# Altium project C27337A_NI_STS_IFX_C55SOI_302149633_V3_04.PrjPcb
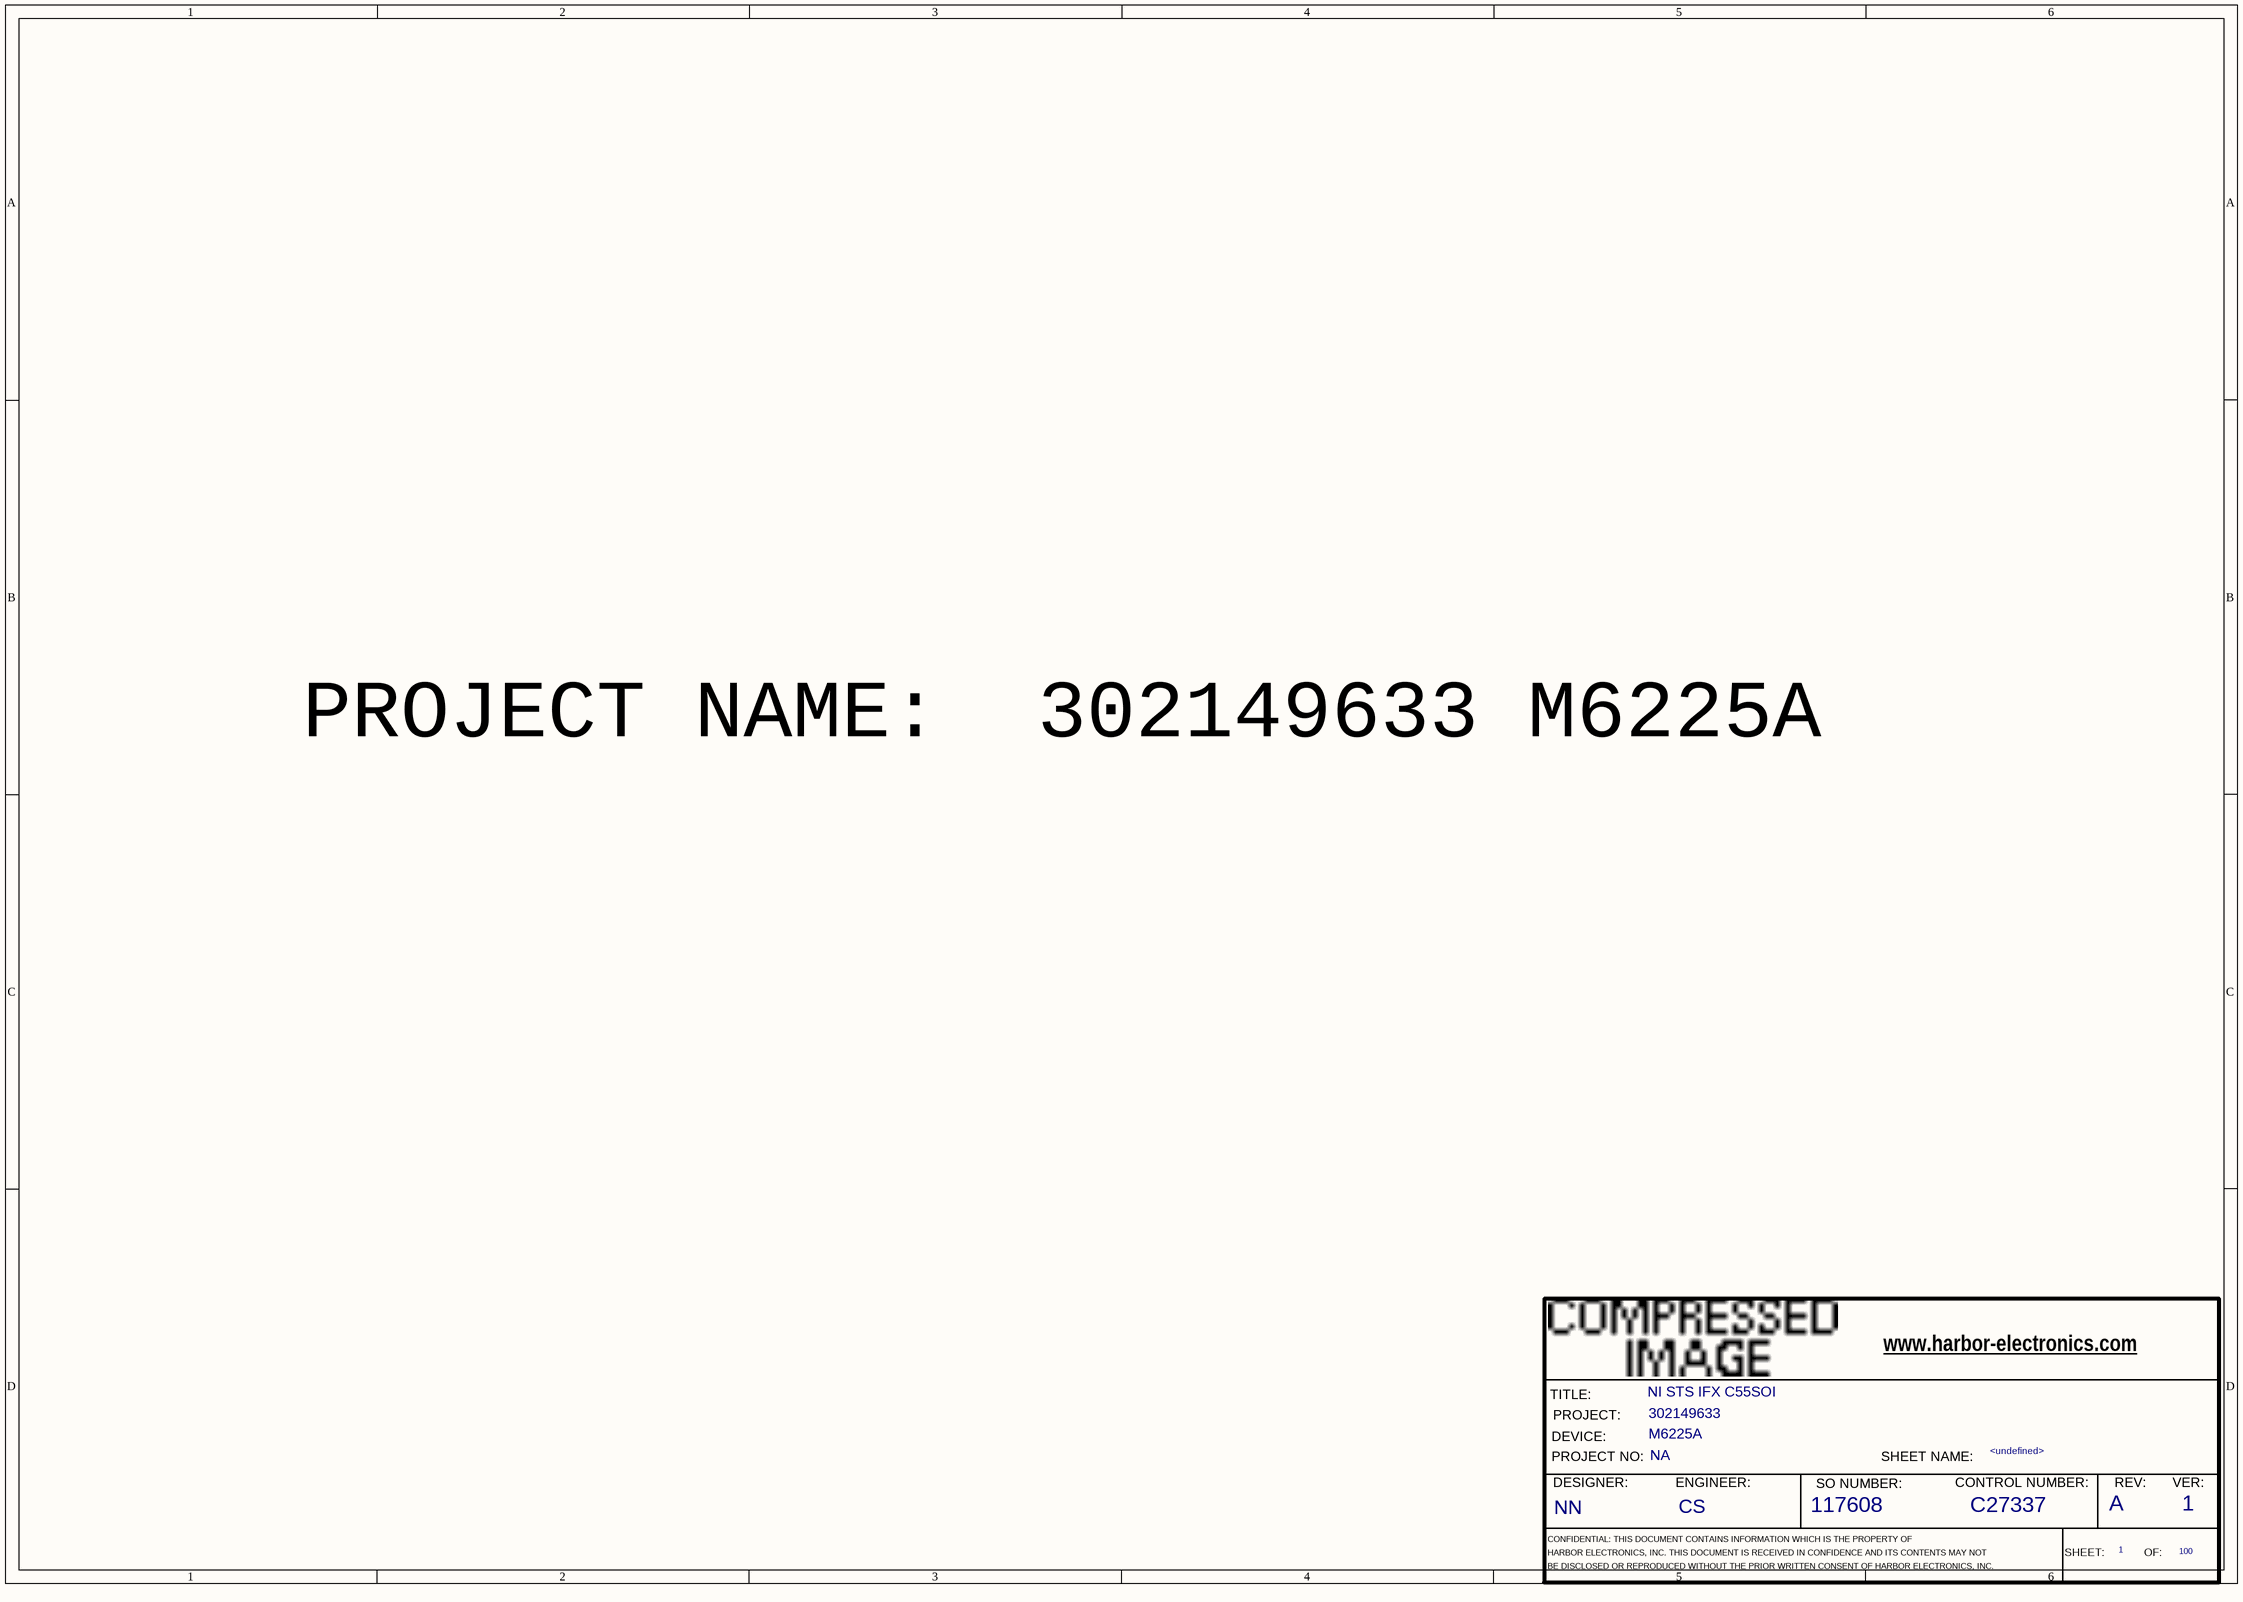
[diagram p0: 01-TITLE.SchDoc]
7 sheets, 29 parts. Net scope: flat (ports and power ports of the same name join across sheets).
Board file: c27337a_ni_sts_ifx_c55soi_302149633_m6225a_v1_23.brd.PcbDoc
Sheets:
  01-TITLE.SchDoc
  02-REVISION.SchDoc
  03-TESTER_CONFIG.SchDoc
  40-DIGITAL.SchDoc
  42-MIO.SchDoc
  47-SOURCES_AWG.SchDoc
  51-BLANK 121-140.SchDoc

## Sheet 01-TITLE.SchDoc
size 420 x 297 mm

### Parts
(Parts that share a designator on the sheet are numbered #1, #2 ... from top to bottom, then left to right.)
*#1  RevCode: A  Title: NI STS IFX C55SOI  Page Number: 1  Page Count: 100  Engineer: CS  Designer: NN  SO Number: 117608  Control Number: C27337  Page Name: <undefined>  PROJECT: 302149633  DEVICE: M6225A  PROJECT NO.: NA  (hidden comment: HE_DEFAULT)  (graphical)

### Notes on the sheet
- PROJECT NAME:  302149633 M6225A
- (in symbol HE_DEFAULT) www.harbor-electronics.com; TITLE:; PROJECT:; DEVICE:; PROJECT NO:; SHEET NAME:; DESIGNER:; ENGINEER:; CONTROL NUMBER:; REV:; VER:; SO NUMBER:; CONFIDENTIAL: THIS DOCUMENT CONTAINS INFORMATION WHICH IS THE PROPERTY OF; HARBOR ELECTRONICS, INC. THIS DOCUMENT IS RECEIVED IN CONFIDENCE AND ITS CONTENTS MAY NOT; SHEET:; OF:; BE DISCLOSED OR REPRODUCED WITHOUT THE PRIOR WRITTEN CONSENT OF HARBOR ELECTRONICS, INC.

### Library data of the parts
*#1 = HE_DEFAULT: Page Size: X; OrgAddr4: Fax: +1 602-431-9633; OrgAddr1: 4050 E. Cotton Center Blvd., Suite 33; OrgAddr2: Phoenix, Arizona 85040 U.S.A.; OrgAddr3: Phone: +1 602-438-1112; Doc: <Title Name>; OrgName: HARBOR; Version: 1

## Sheet 02-REVISION.SchDoc
size 420 x 297 mm
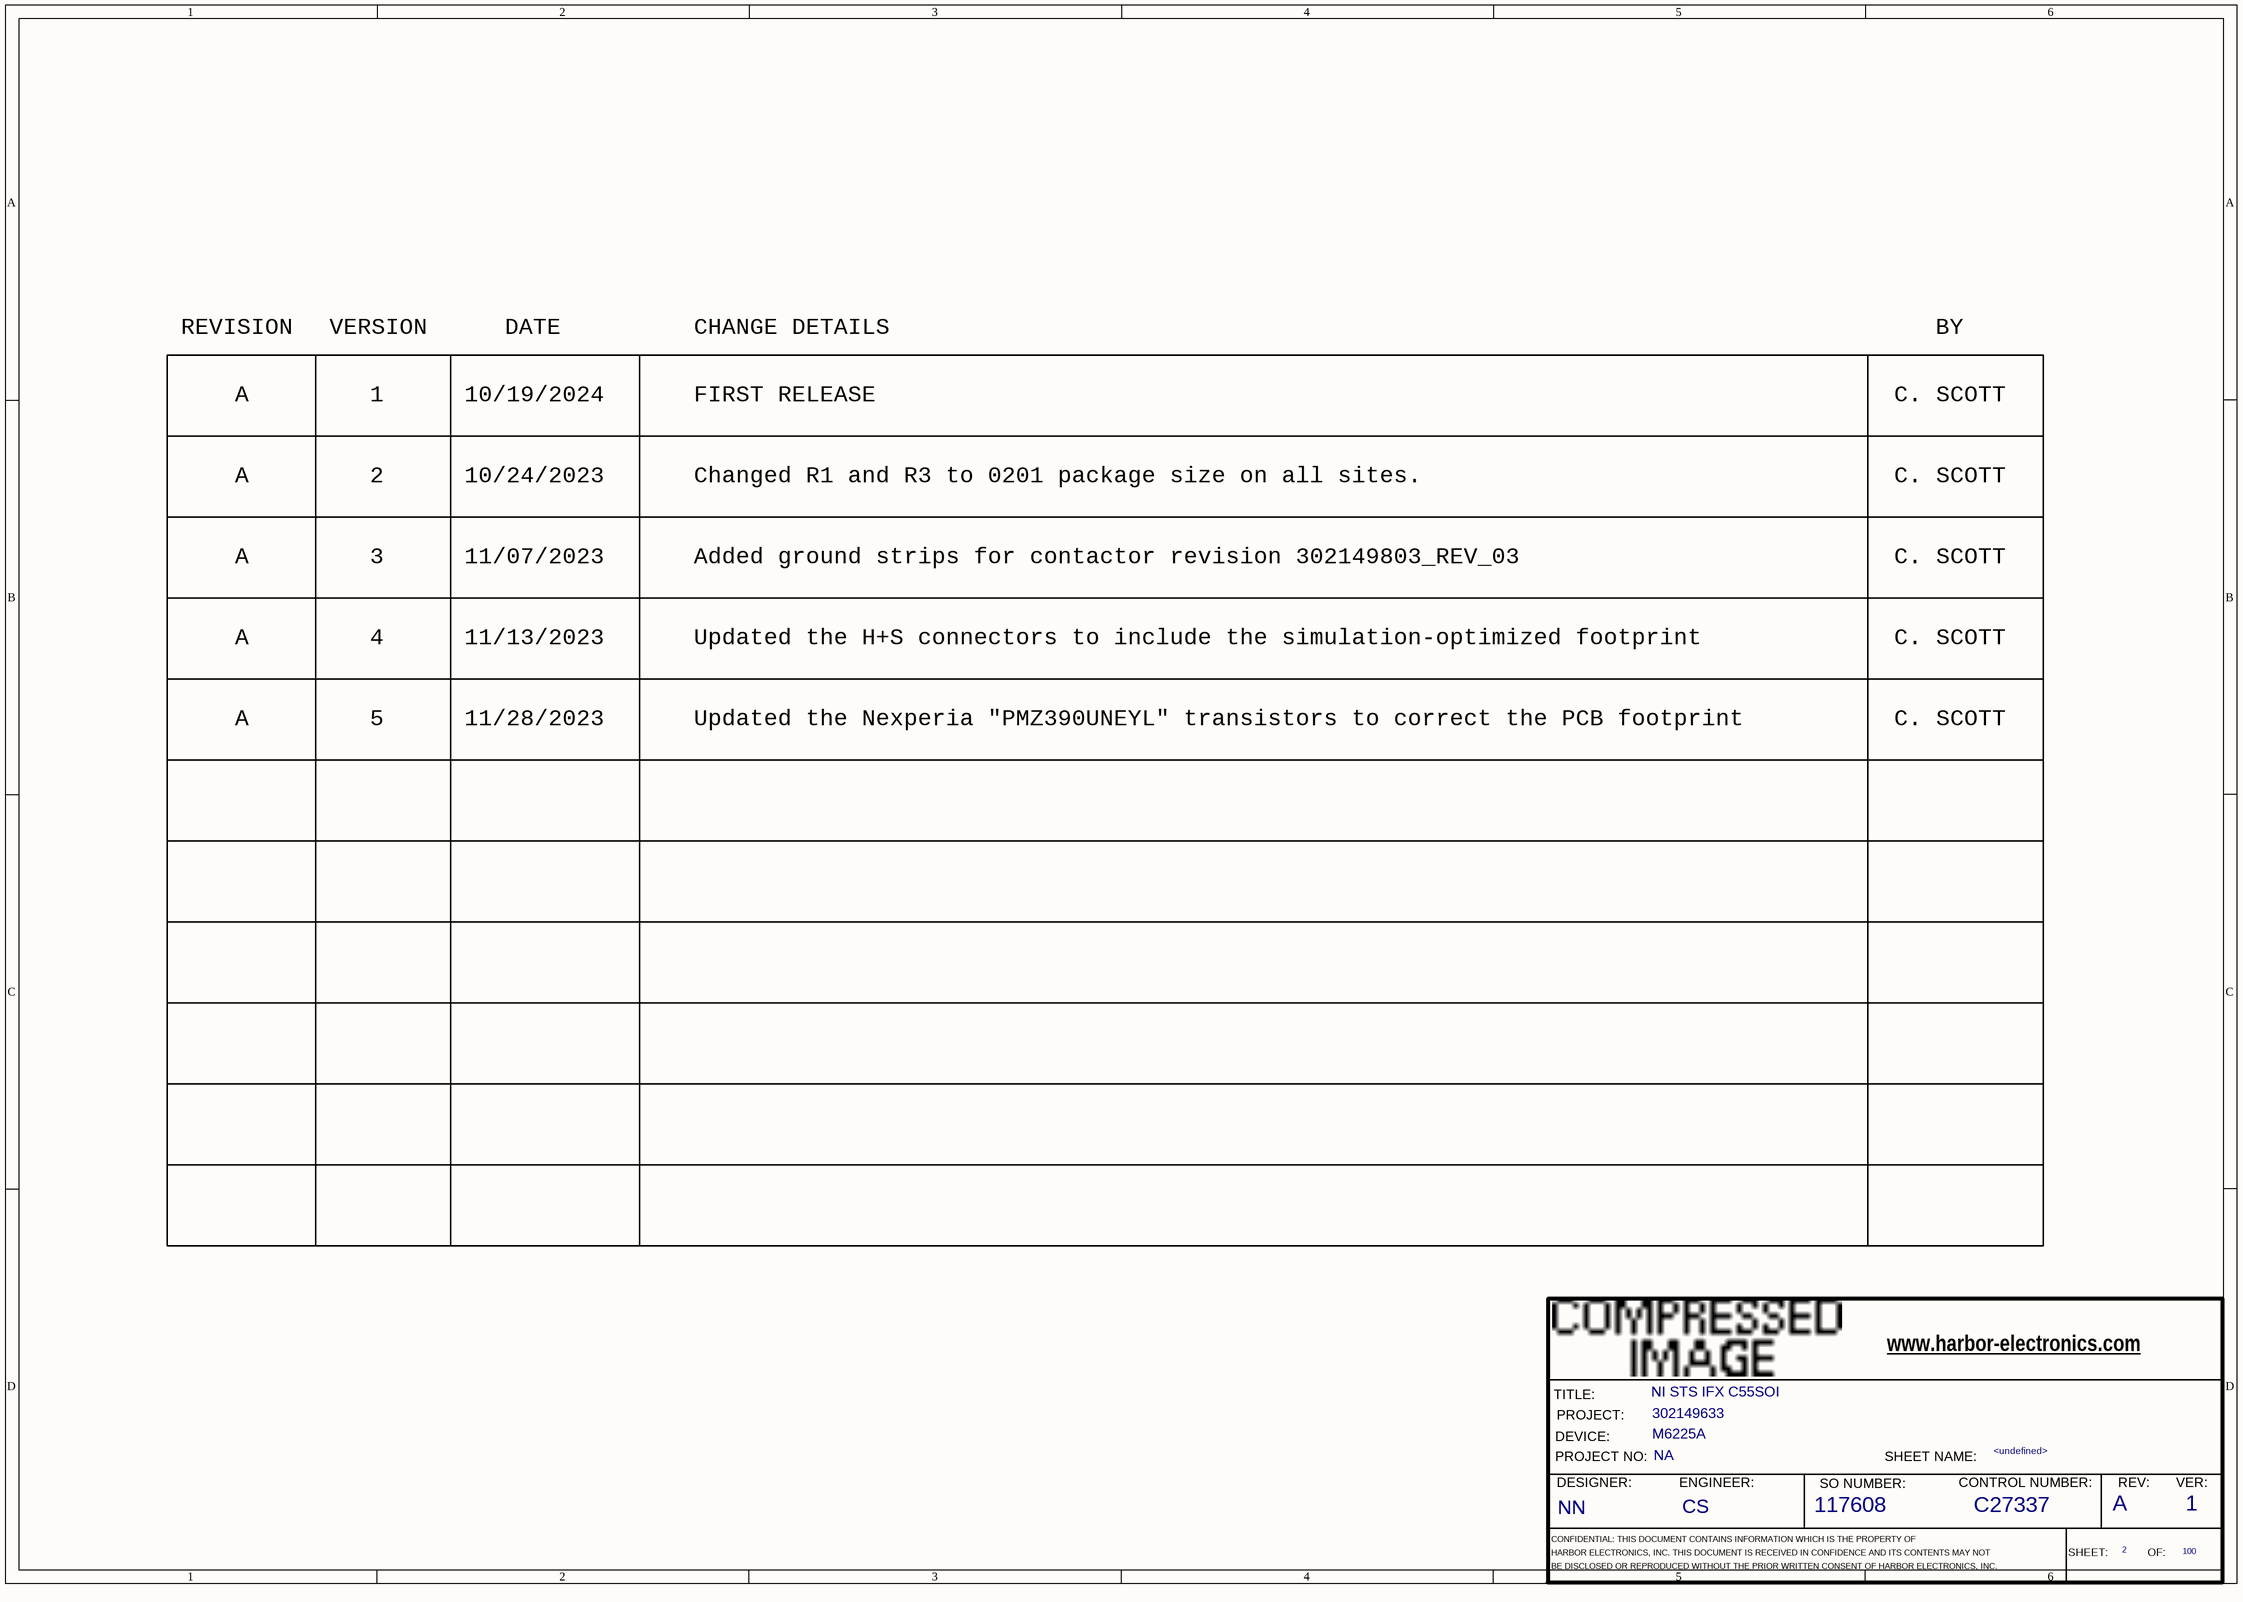
[diagram p1: 02-REVISION.SchDoc]

### Parts
(Parts that share a designator on the sheet are numbered #1, #2 ... from top to bottom, then left to right.)
*#2  RevCode: A  Title: NI STS IFX C55SOI  Page Number: 2  Page Count: 100  Engineer: CS  Designer: NN  SO Number: 117608  Control Number: C27337  Version: 1  Page Name: <undefined>  PROJECT: 302149633  DEVICE: M6225A  PROJECT NO.: NA  (hidden comment: HE_DEFAULT)  (graphical)

### Notes on the sheet
- REVISION
- VERSION
- DATE
- CHANGE DETAILS
- BY
- A
- 1
- 10/19/2024
- FIRST RELEASE
- C. SCOTT
- 2
- 10/24/2023
- Changed R1 and R3 to 0201 package size on all sites.
- 3
- 11/07/2023
- Added ground strips for contactor revision 302149803_REV_03
- 4
- 11/13/2023
- Updated the H+S connectors to include the simulation-optimized footprint
- 5
- 11/28/2023
- Updated the Nexperia "PMZ390UNEYL" transistors to correct the PCB footprint
- (in symbol HE_DEFAULT) www.harbor-electronics.com; TITLE:; PROJECT:; DEVICE:; PROJECT NO:; SHEET NAME:; DESIGNER:; ENGINEER:; CONTROL NUMBER:; REV:; VER:; SO NUMBER:; CONFIDENTIAL: THIS DOCUMENT CONTAINS INFORMATION WHICH IS THE PROPERTY OF; HARBOR ELECTRONICS, INC. THIS DOCUMENT IS RECEIVED IN CONFIDENCE AND ITS CONTENTS MAY NOT; SHEET:; OF:; BE DISCLOSED OR REPRODUCED WITHOUT THE PRIOR WRITTEN CONSENT OF HARBOR ELECTRONICS, INC.

### Library data of the parts
*#2 = HE_DEFAULT: as *#1 on sheet 01-TITLE

## Sheet 03-TESTER_CONFIG.SchDoc
size 594 x 420 mm
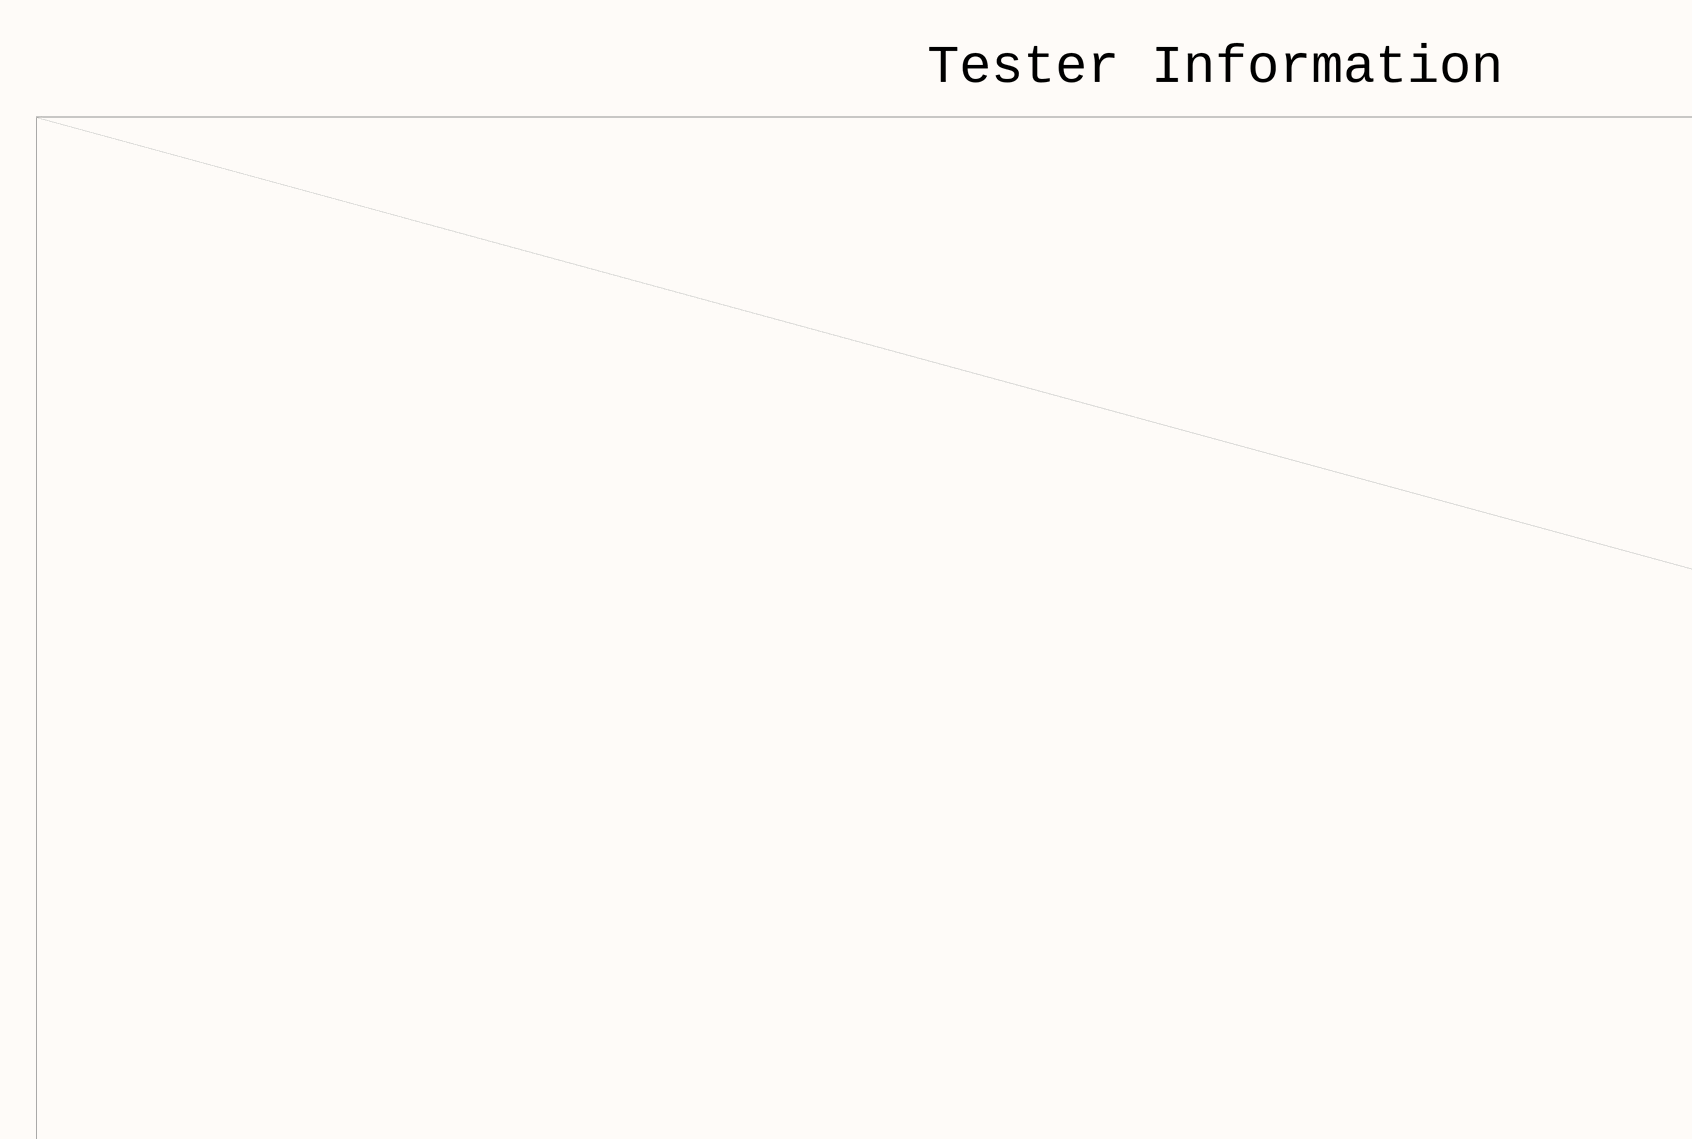
[diagram p2: 03-TESTER_CONFIG.SchDoc, top column 1 of 4]
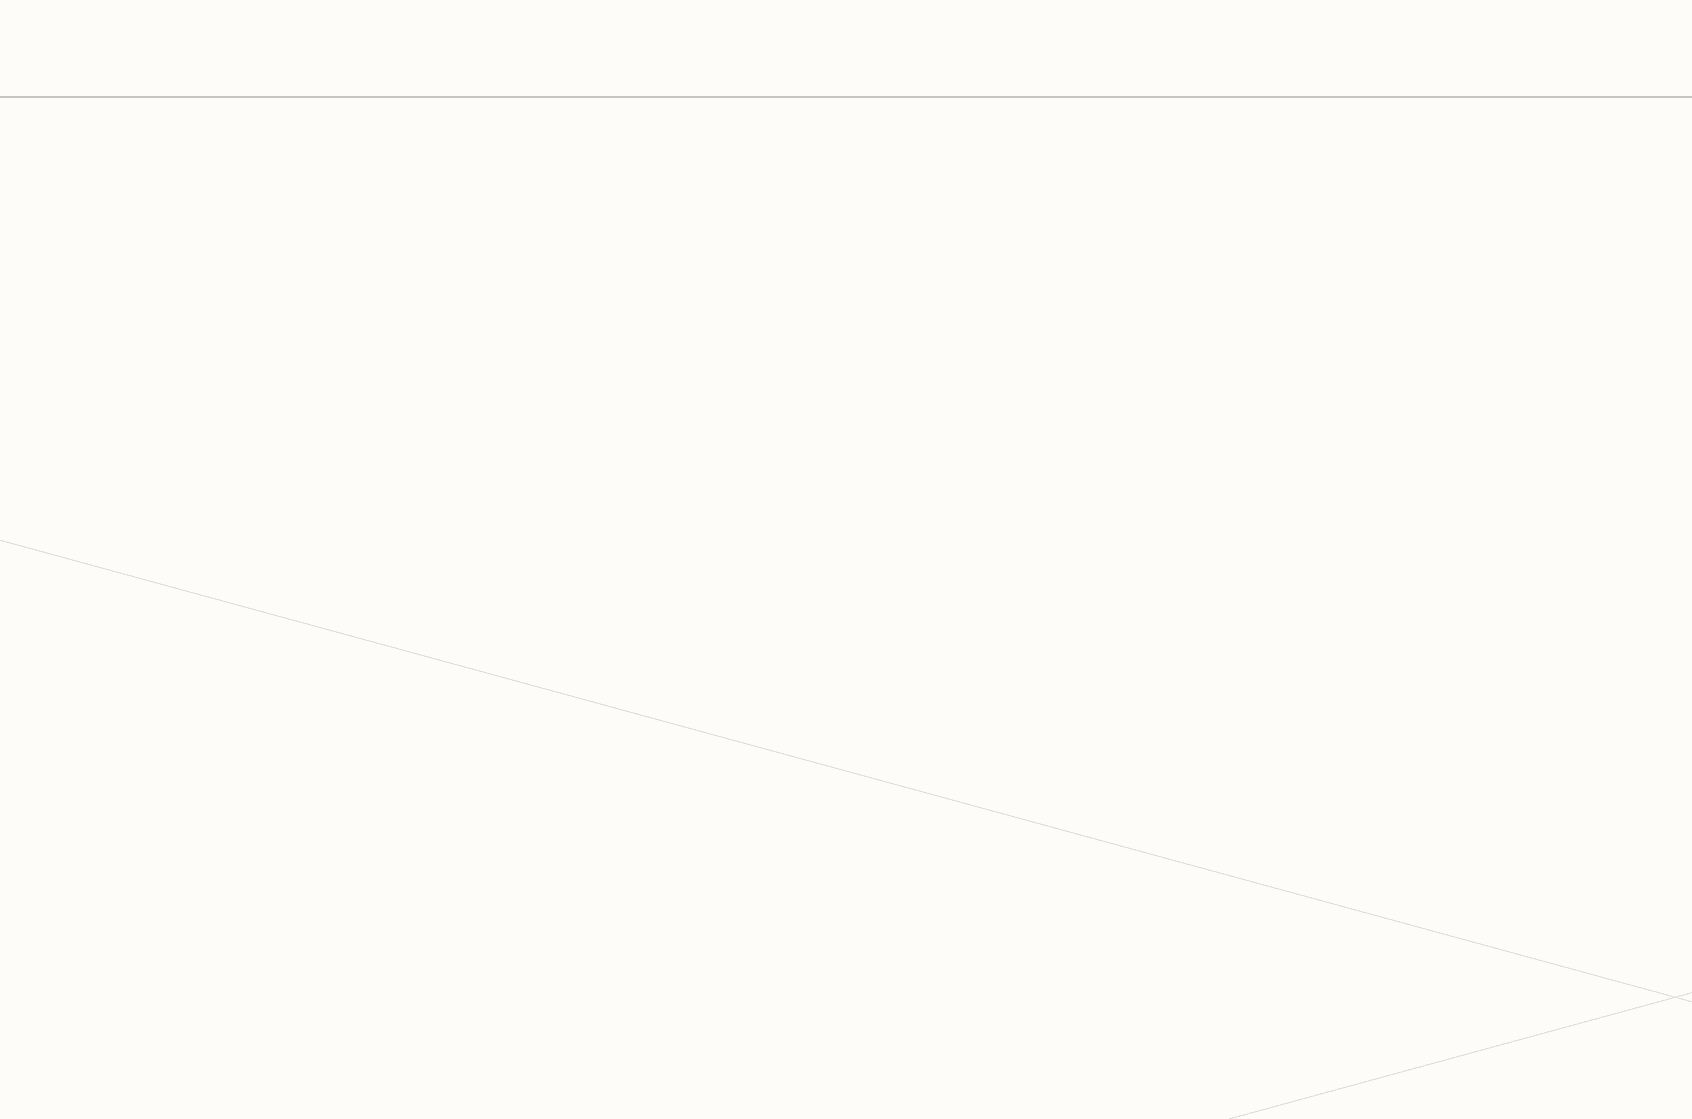
[diagram p3: 03-TESTER_CONFIG.SchDoc, top column 2 of 4]
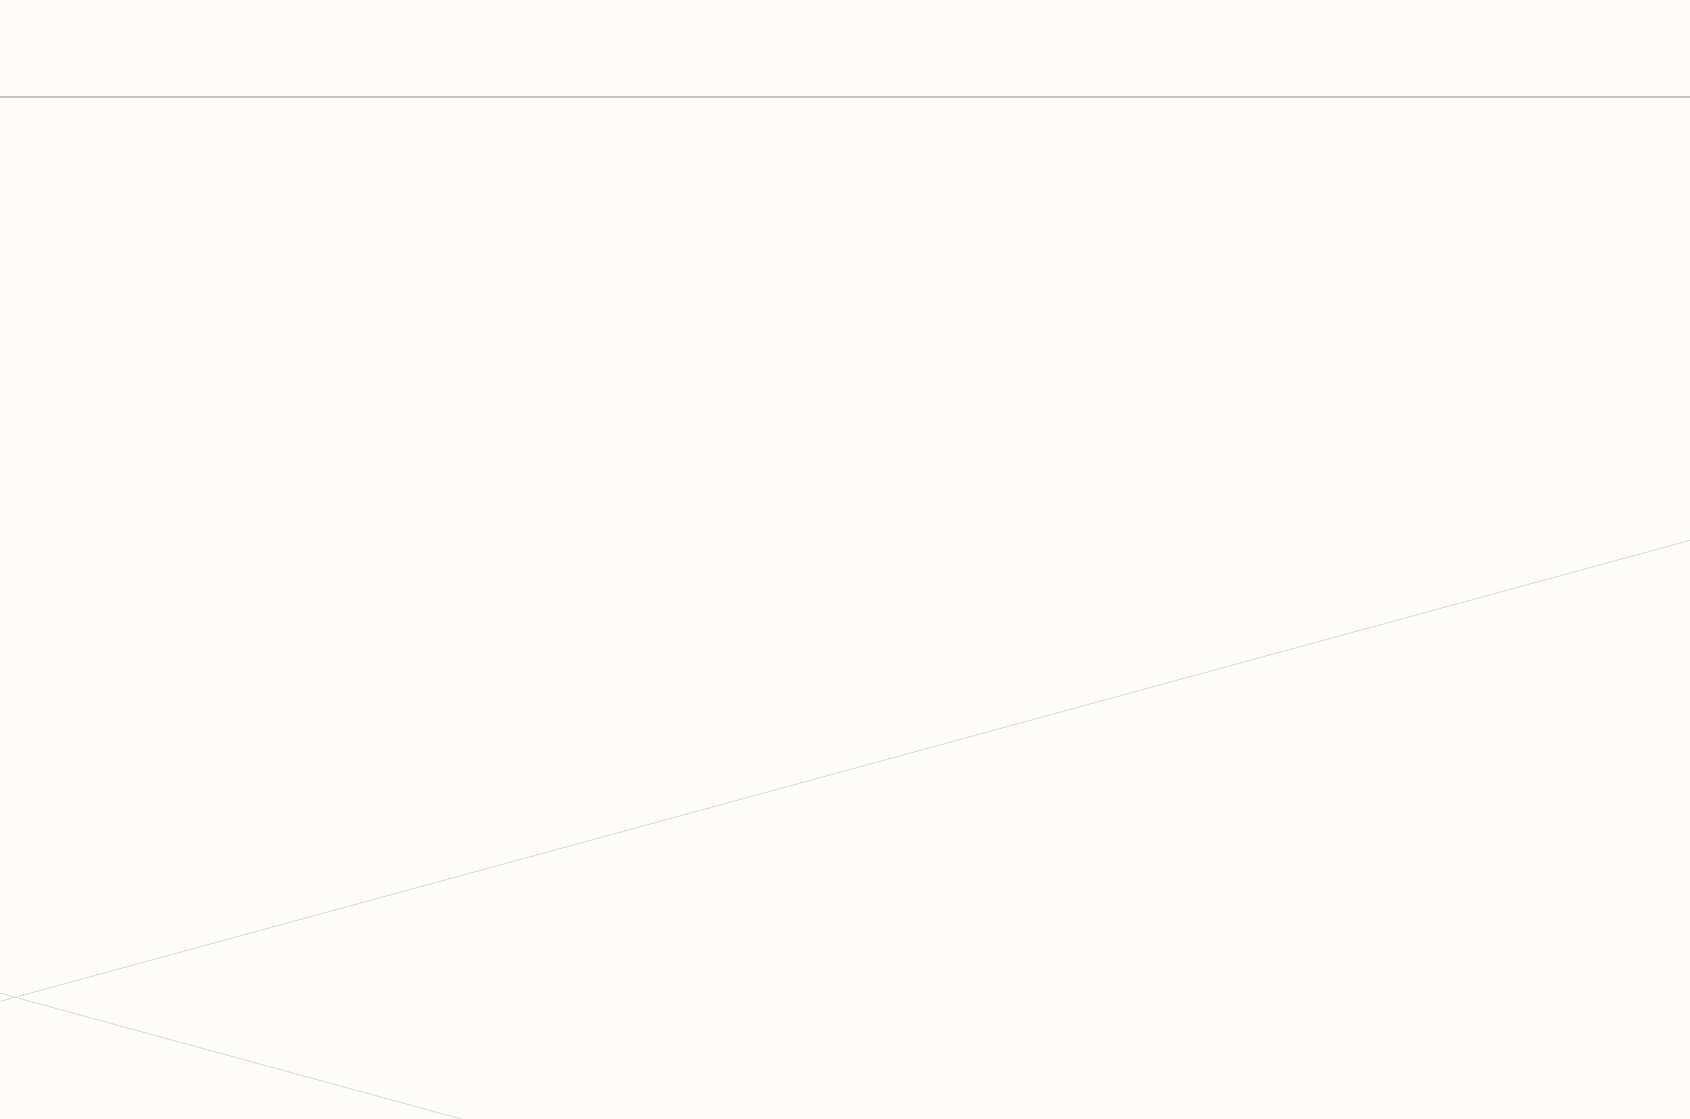
[diagram p4: 03-TESTER_CONFIG.SchDoc, top column 3 of 4]
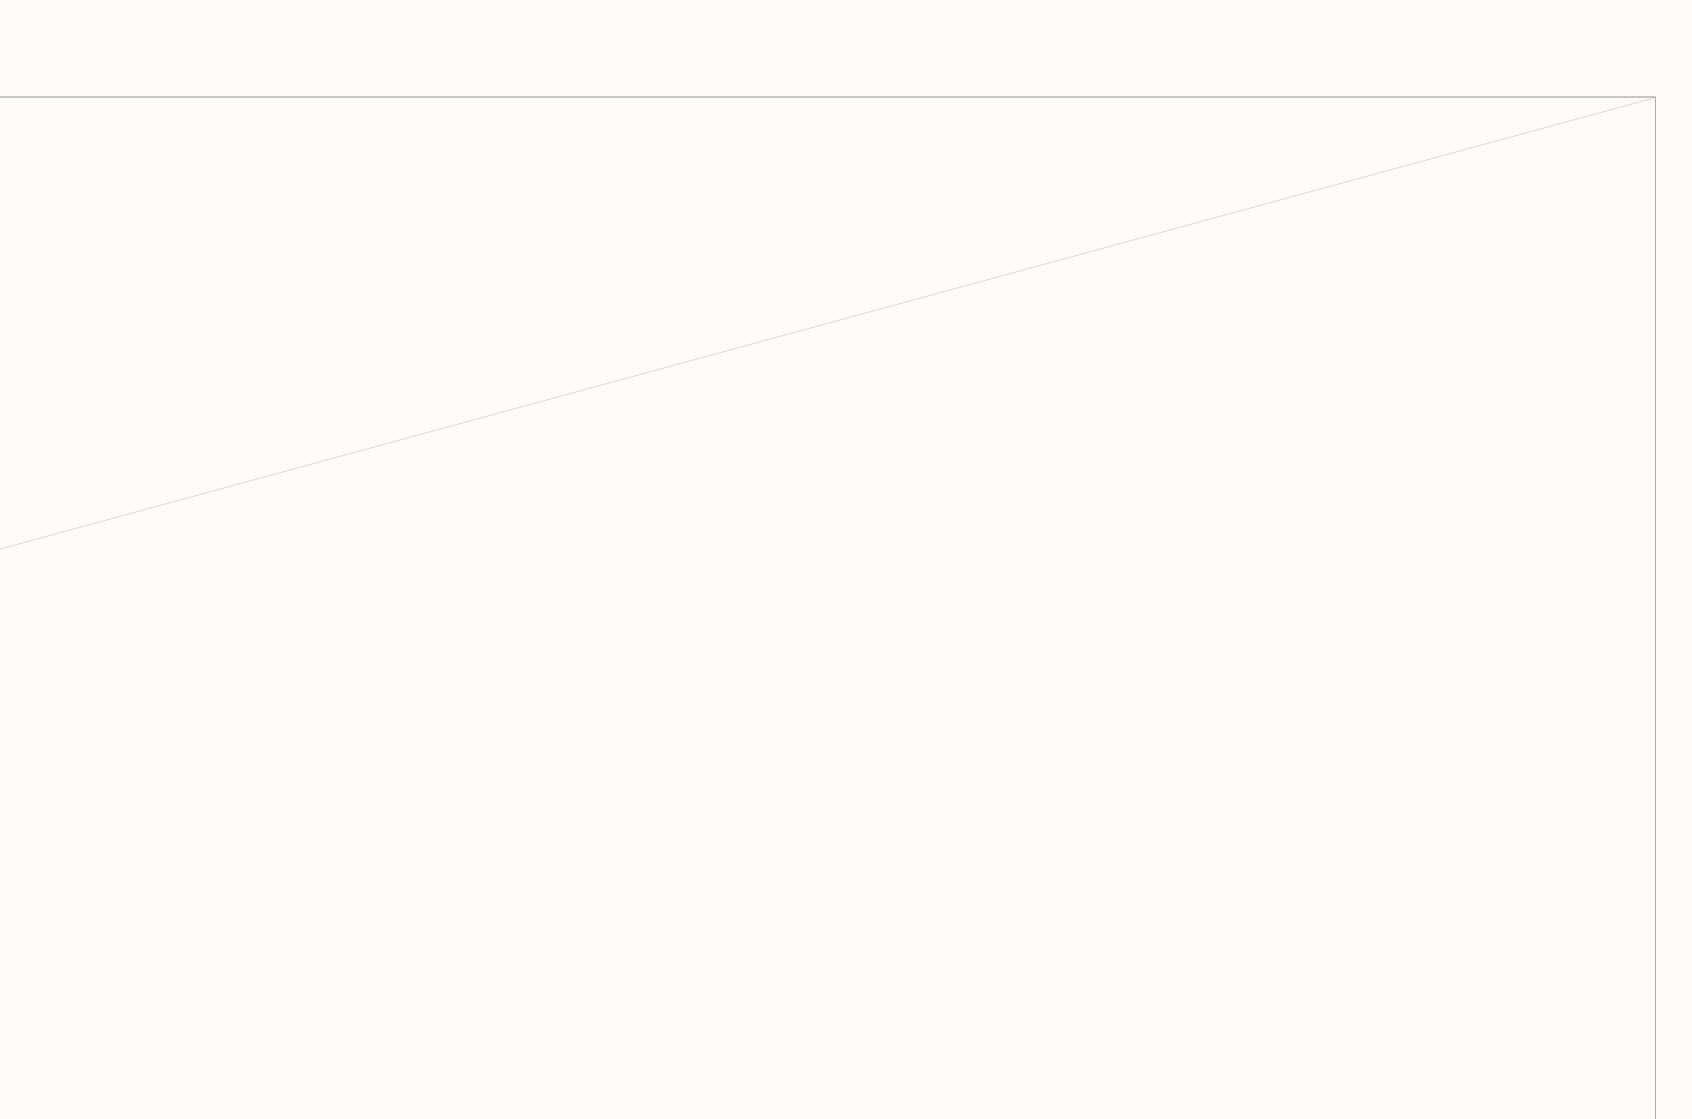
[diagram p5: 03-TESTER_CONFIG.SchDoc, top column 4 of 4]
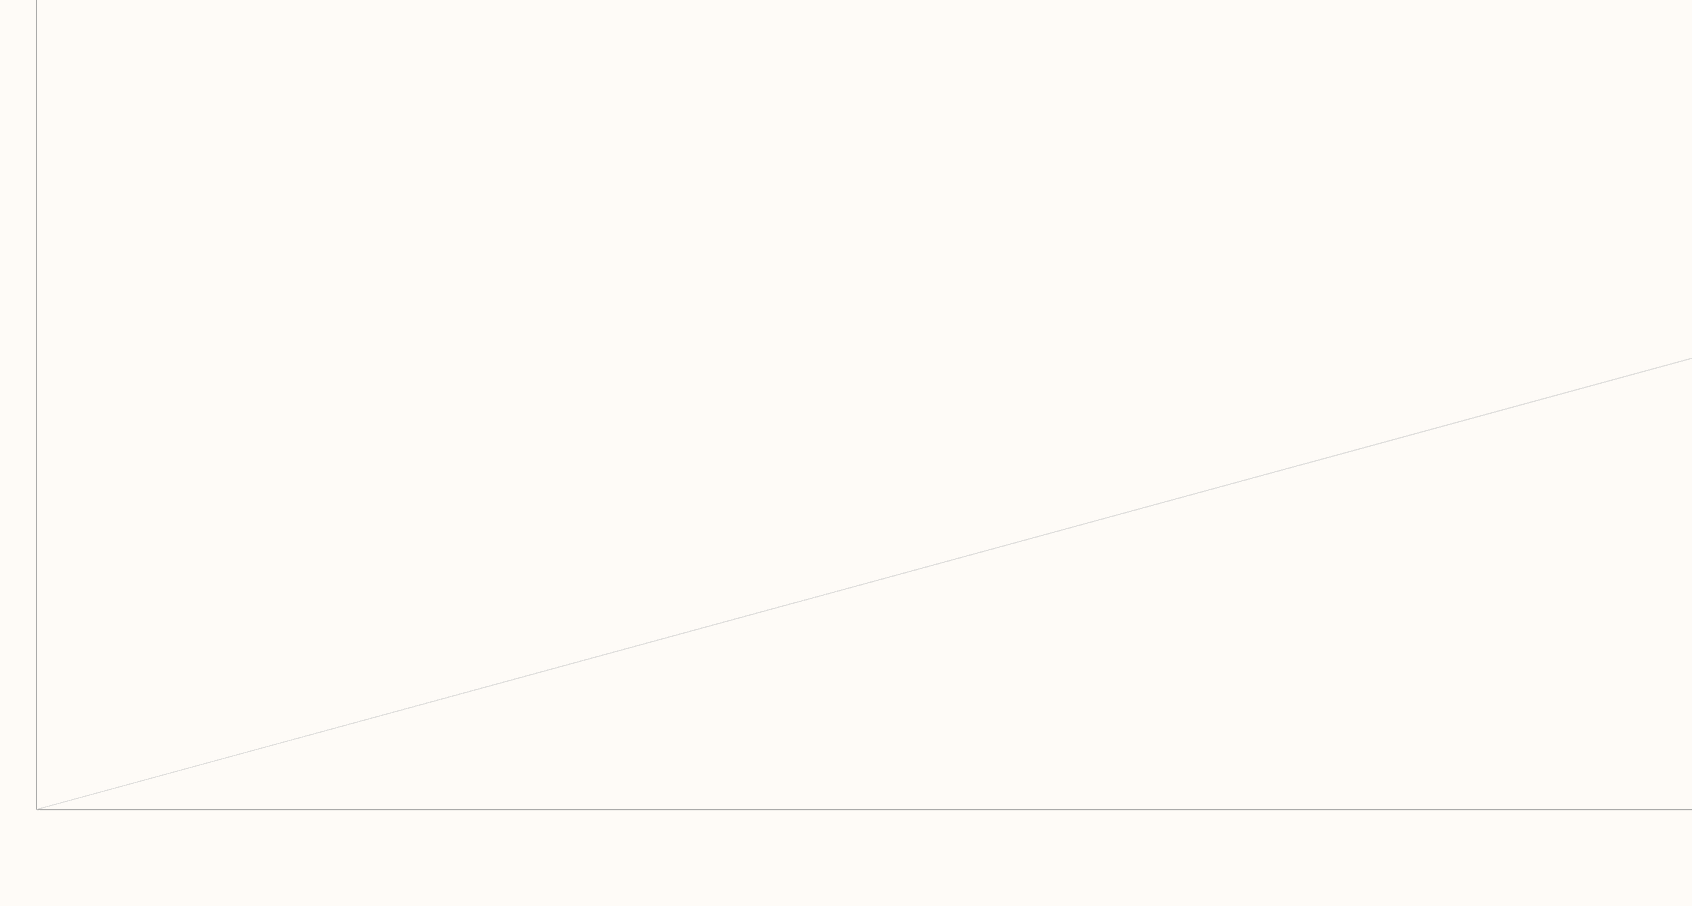
[diagram p6: 03-TESTER_CONFIG.SchDoc, bottom column 1 of 4]
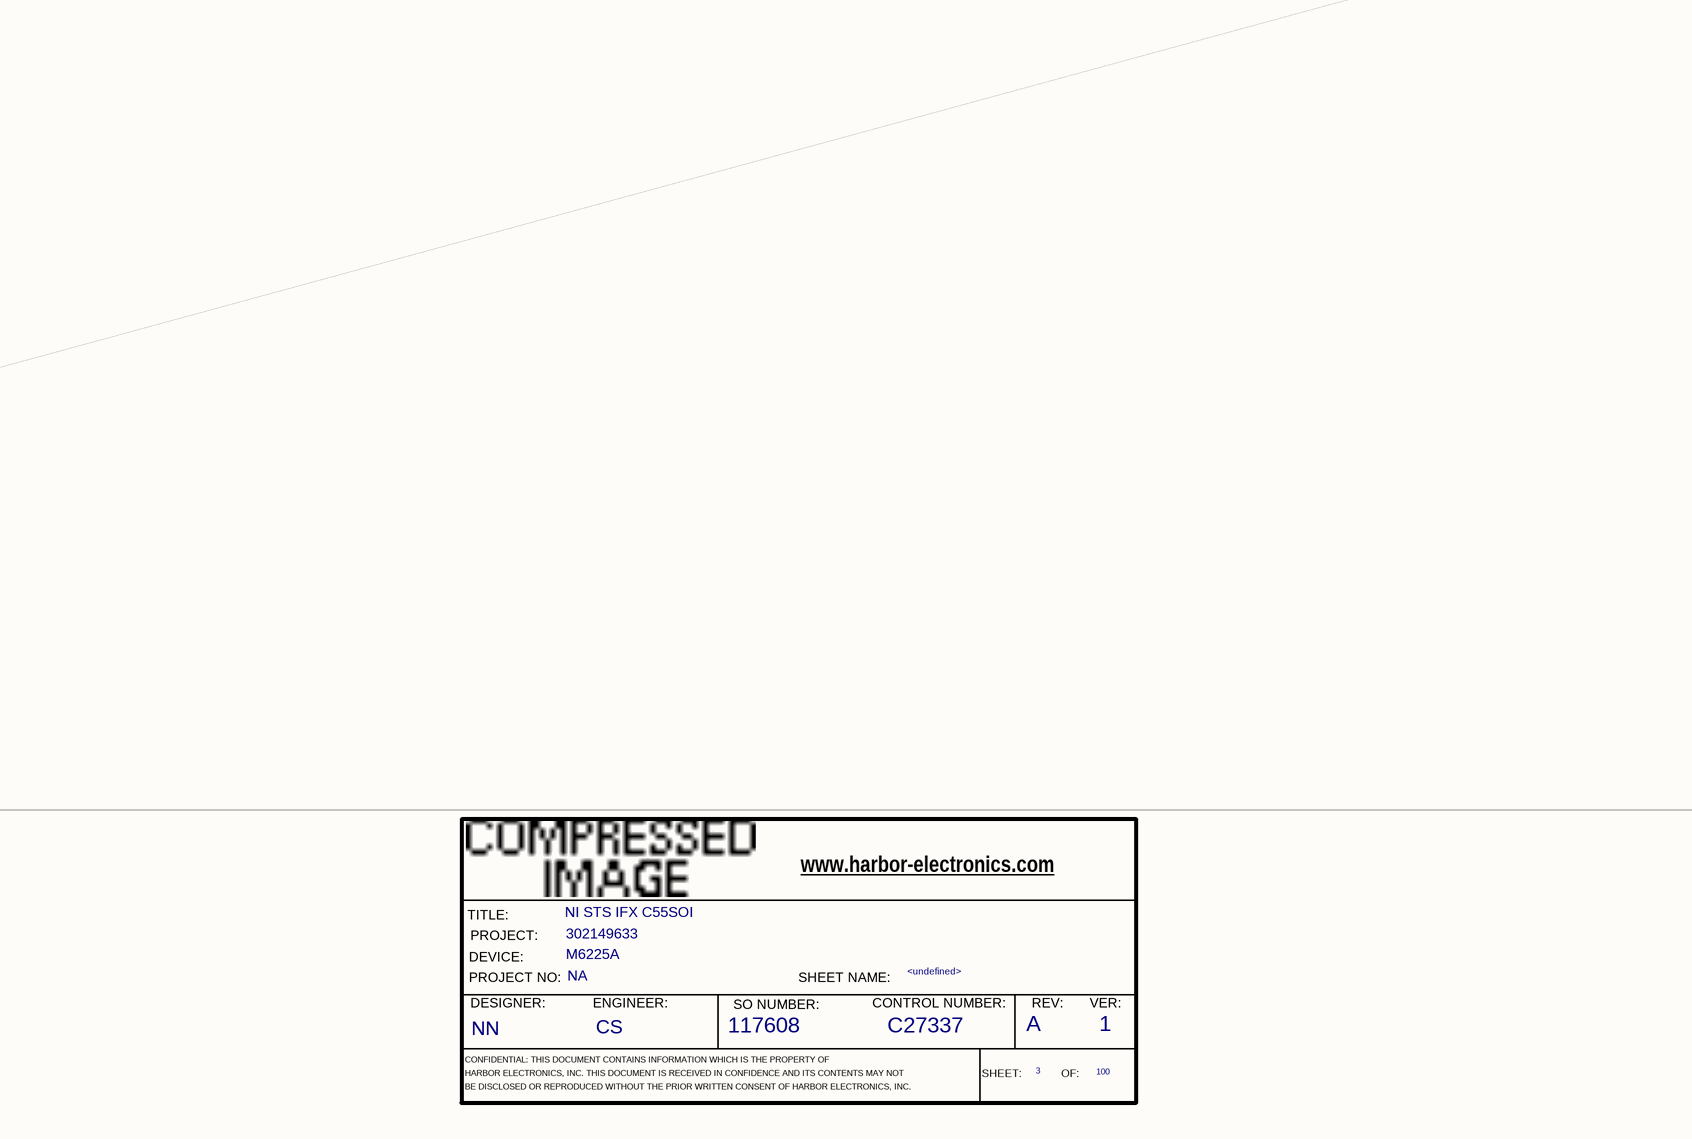
[diagram p7: 03-TESTER_CONFIG.SchDoc, bottom column 2 of 4]
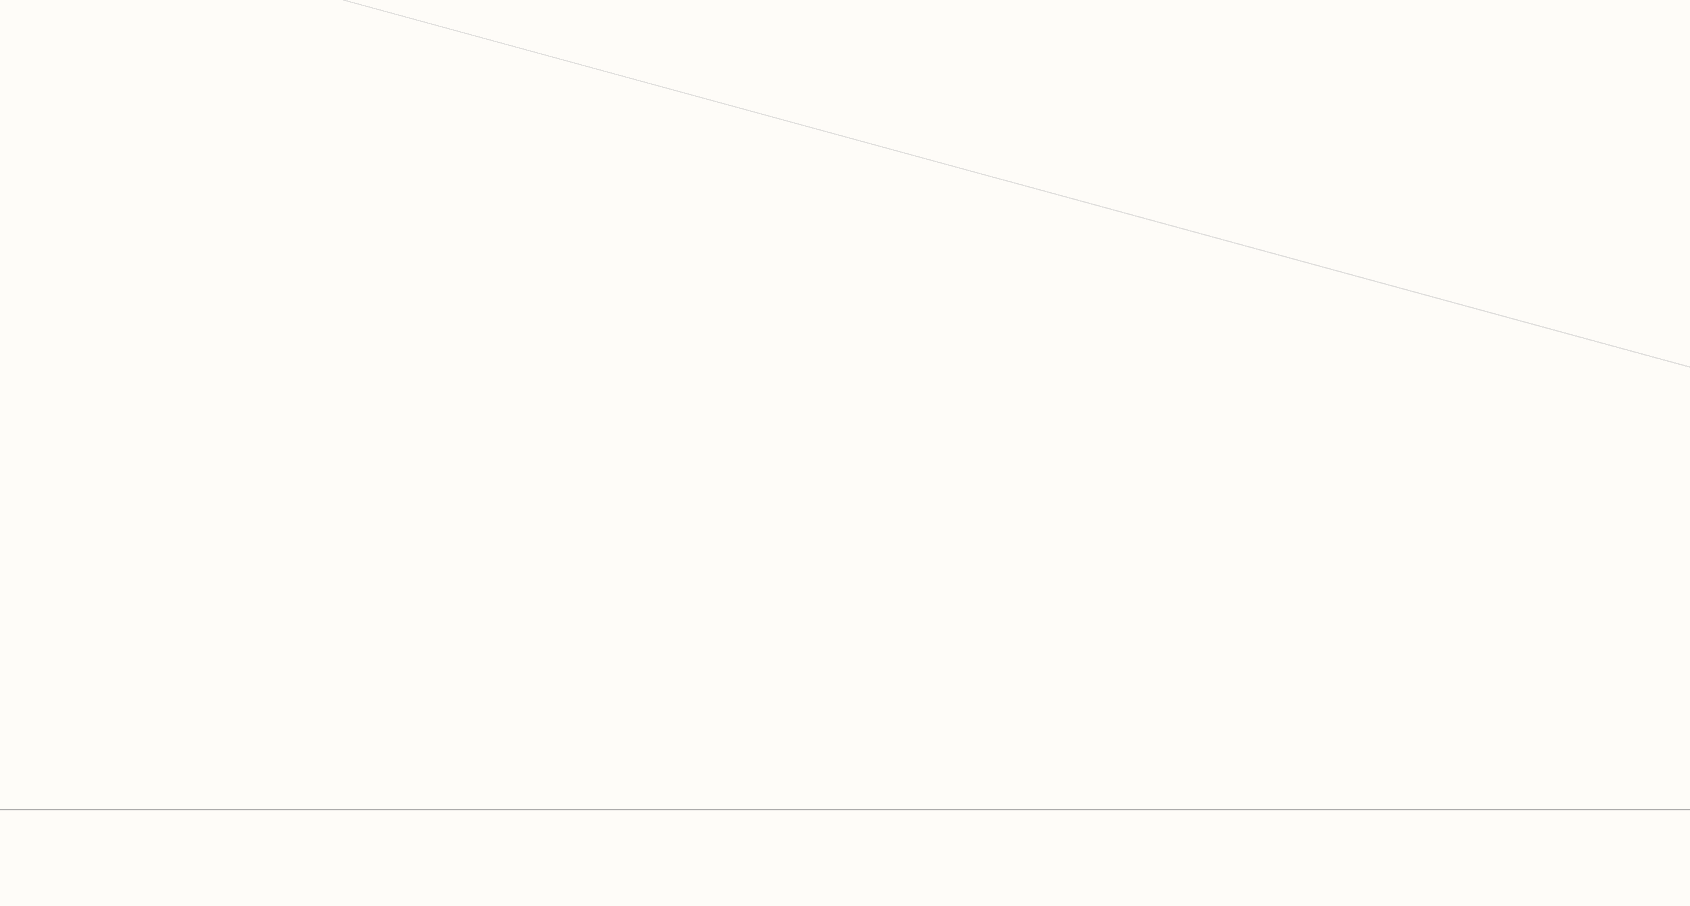
[diagram p8: 03-TESTER_CONFIG.SchDoc, bottom column 3 of 4]
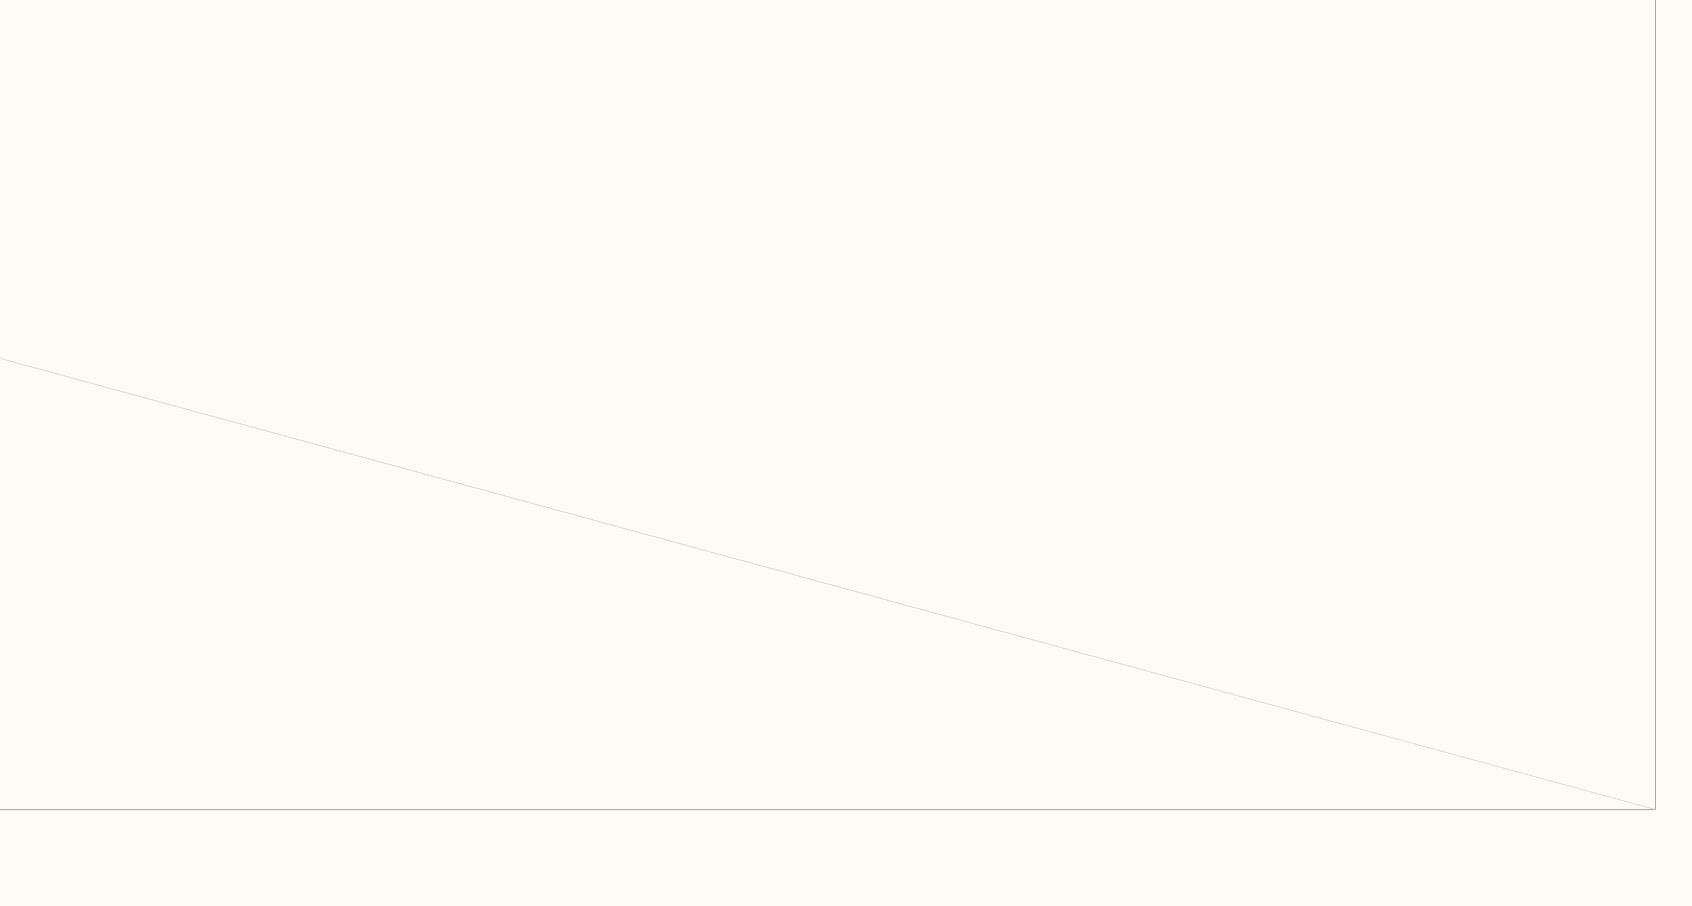
[diagram p9: 03-TESTER_CONFIG.SchDoc, bottom column 4 of 4]

### Parts
(Parts that share a designator on the sheet are numbered #1, #2 ... from top to bottom, then left to right.)
*#3  RevCode: A  Title: NI STS IFX C55SOI  Page Number: 3  Page Count: 100  Engineer: CS  Designer: NN  SO Number: 117608  Control Number: C27337  Version: 1  Page Name: <undefined>  PROJECT: 302149633  DEVICE: M6225A  PROJECT NO.: NA  (hidden comment: HE_DEFAULT)  (graphical)

### Notes on the sheet
- Tester Information
- (in symbol HE_DEFAULT) www.harbor-electronics.com; TITLE:; PROJECT:; DEVICE:; PROJECT NO:; SHEET NAME:; DESIGNER:; ENGINEER:; SO NUMBER:; CONTROL NUMBER:; REV:; VER:; CONFIDENTIAL: THIS DOCUMENT CONTAINS INFORMATION WHICH IS THE PROPERTY OF; HARBOR ELECTRONICS, INC. THIS DOCUMENT IS RECEIVED IN CONFIDENCE AND ITS CONTENTS MAY NOT; SHEET:; OF:; BE DISCLOSED OR REPRODUCED WITHOUT THE PRIOR WRITTEN CONSENT OF HARBOR ELECTRONICS, INC.

### Library data of the parts
*#3 = HE_DEFAULT: as *#1 on sheet 01-TITLE

## Sheet 40-DIGITAL.SchDoc
size 594 x 420 mm
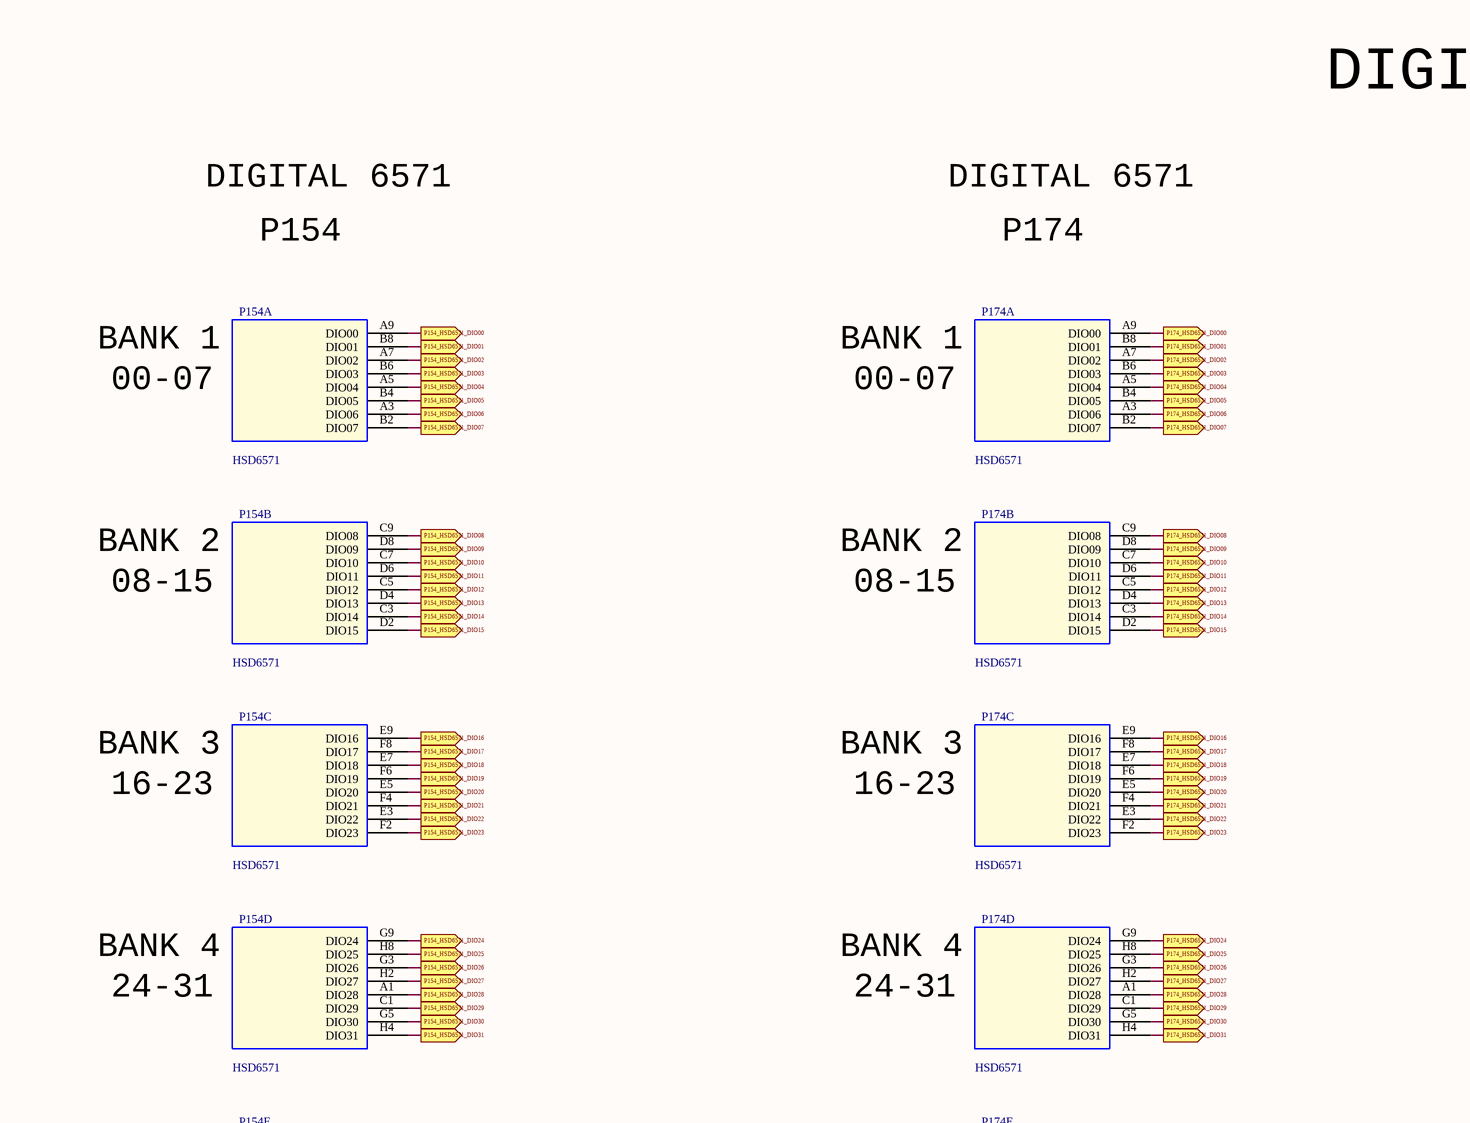
[diagram p10: 40-DIGITAL.SchDoc, top left]
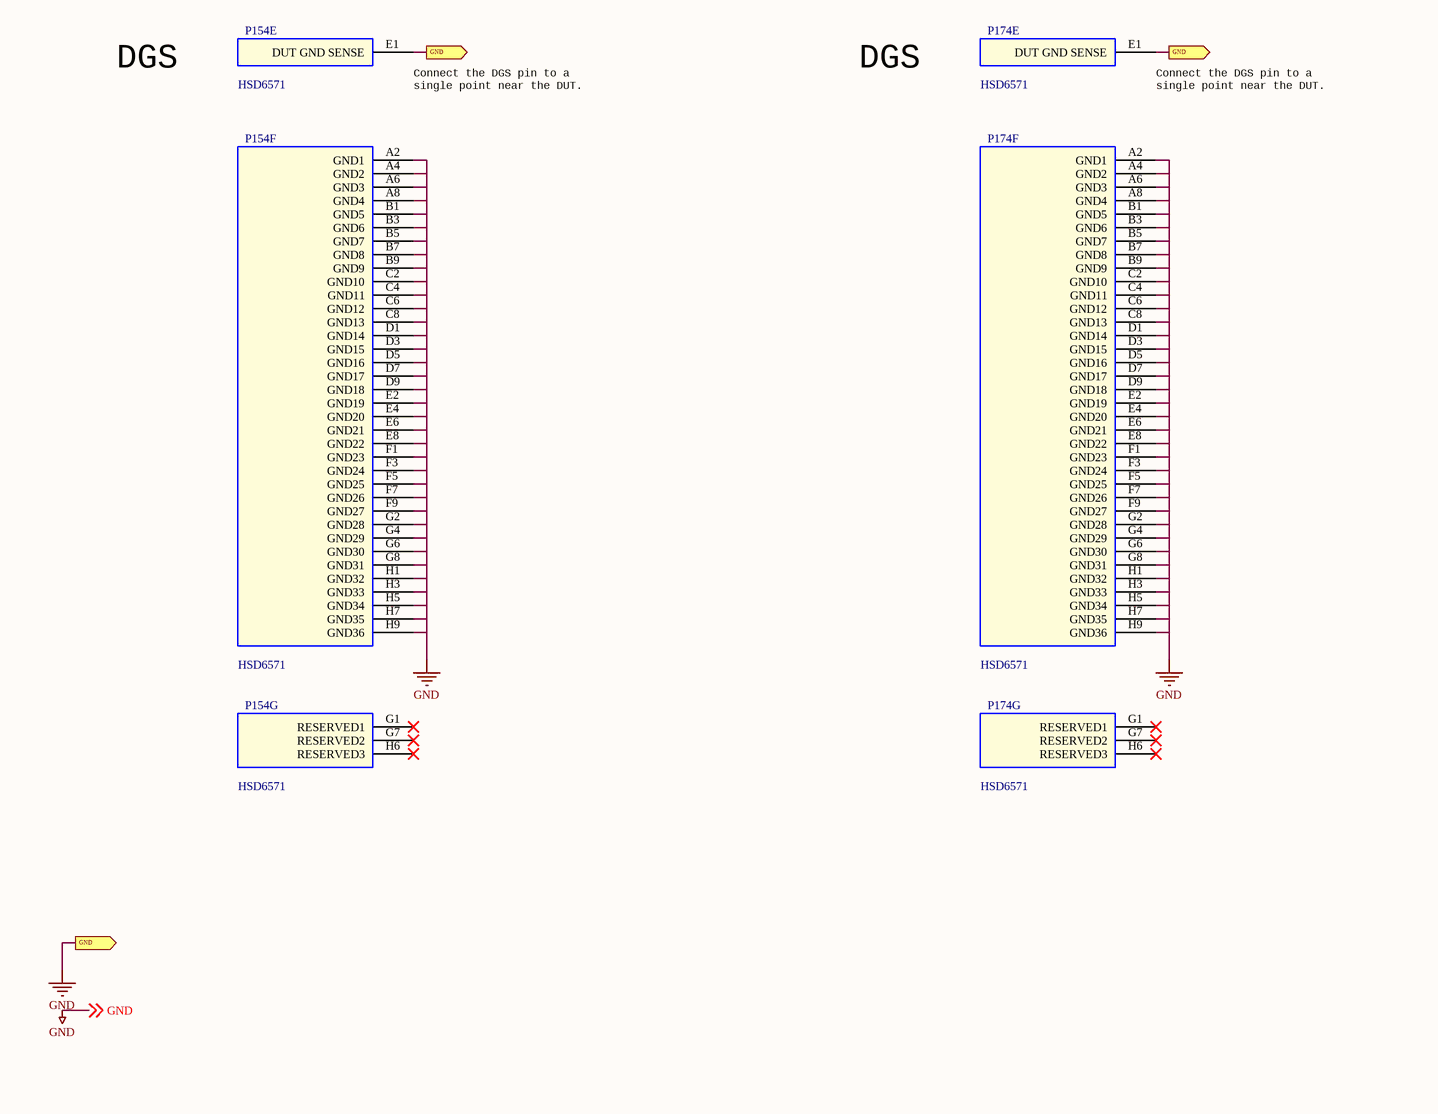
[diagram p11: 40-DIGITAL.SchDoc, bottom left]
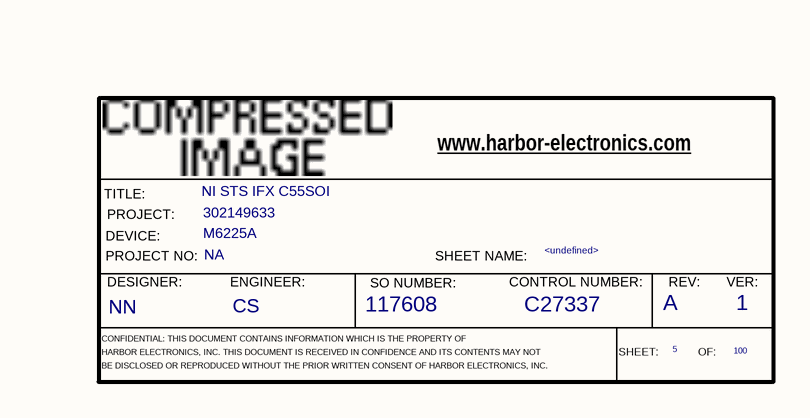
[diagram p12: 40-DIGITAL.SchDoc, bottom right]

### Parts
(Parts that share a designator on the sheet are numbered #1, #2 ... from top to bottom, then left to right.)
*#4  RevCode: A  Title: NI STS IFX C55SOI  Page Number: 5  Page Count: 100  Engineer: CS  Designer: NN  SO Number: 117608  Control Number: C27337  Version: 1  Page Name: <undefined>  PROJECT: 302149633  DEVICE: M6225A  PROJECT NO.: NA  (hidden comment: HE_DEFAULT)  (graphical)
P154  HSD6571  [285092A-08_72PIN]  (parts A,B,C,D,E,F,G of 7)
P174  HSD6571  [285092A-08_72PIN]  (parts A,B,C,D,E,F,G of 7)

### Ports
GND (out), P154_HSD6571_DIO00 (out), P154_HSD6571_DIO01 (out), P154_HSD6571_DIO02 (out), P154_HSD6571_DIO03 (out), P154_HSD6571_DIO04 (out), P154_HSD6571_DIO05 (out), P154_HSD6571_DIO06 (out), P154_HSD6571_DIO07 (out), P154_HSD6571_DIO08 (out), P154_HSD6571_DIO09 (out), P154_HSD6571_DIO10 (out), P154_HSD6571_DIO11 (out), P154_HSD6571_DIO12 (out), P154_HSD6571_DIO13 (out), P154_HSD6571_DIO14 (out), P154_HSD6571_DIO15 (out), P154_HSD6571_DIO16 (out), P154_HSD6571_DIO17 (out), P154_HSD6571_DIO18 (out), P154_HSD6571_DIO19 (out), P154_HSD6571_DIO20 (out), P154_HSD6571_DIO21 (out), P154_HSD6571_DIO22 (out), P154_HSD6571_DIO23 (out), P154_HSD6571_DIO24 (out), P154_HSD6571_DIO25 (out), P154_HSD6571_DIO26 (out), P154_HSD6571_DIO27 (out), P154_HSD6571_DIO28 (out), P154_HSD6571_DIO29 (out), P154_HSD6571_DIO30 (out), P154_HSD6571_DIO31 (out), P174_HSD6571_DIO00 (out), P174_HSD6571_DIO01 (out), P174_HSD6571_DIO02 (out), P174_HSD6571_DIO03 (out), P174_HSD6571_DIO04 (out), P174_HSD6571_DIO05 (out), P174_HSD6571_DIO06 (out), P174_HSD6571_DIO07 (out), P174_HSD6571_DIO08 (out), P174_HSD6571_DIO09 (out), P174_HSD6571_DIO10 (out), P174_HSD6571_DIO11 (out), P174_HSD6571_DIO12 (out), P174_HSD6571_DIO13 (out), P174_HSD6571_DIO14 (out), P174_HSD6571_DIO15 (out), P174_HSD6571_DIO16 (out), P174_HSD6571_DIO17 (out), P174_HSD6571_DIO18 (out), P174_HSD6571_DIO19 (out), P174_HSD6571_DIO20 (out), P174_HSD6571_DIO21 (out), P174_HSD6571_DIO22 (out), P174_HSD6571_DIO23 (out), P174_HSD6571_DIO24 (out), P174_HSD6571_DIO25 (out), P174_HSD6571_DIO26 (out), P174_HSD6571_DIO27 (out), P174_HSD6571_DIO28 (out), P174_HSD6571_DIO29 (out), P174_HSD6571_DIO30 (out), P174_HSD6571_DIO31 (out)

### Nets
GND: P154.A2(GND1) P154.A4(GND2) P154.A6(GND3) P154.A8(GND4) P154.B1(GND5) P154.B3(GND6) P154.B5(GND7) P154.B7(GND8) P154.B9(GND9) P154.C2(GND10) P154.C4(GND11) P154.C6(GND12) P154.C8(GND13) P154.D1(GND14) P154.D3(GND15) P154.D5(GND16) P154.D7(GND17) P154.D9(GND18) P154.E1(DUT_GND_SENSE) P154.E2(GND19) P154.E4(GND20) P154.E6(GND21) P154.E8(GND22) P154.F1(GND23) P154.F3(GND24) P154.F5(GND25) P154.F7(GND26) P154.F9(GND27) P154.G2(GND28) P154.G4(GND29) P154.G6(GND30) P154.G8(GND31) P154.H1(GND32) P154.H3(GND33) P154.H5(GND34) P154.H7(GND35) P154.H9(GND36) P174.A2(GND1) P174.A4(GND2) P174.A6(GND3) P174.A8(GND4) P174.B1(GND5) P174.B3(GND6) P174.B5(GND7) P174.B7(GND8) P174.B9(GND9) P174.C2(GND10) P174.C4(GND11) P174.C6(GND12) P174.C8(GND13) P174.D1(GND14) P174.D3(GND15) P174.D5(GND16) P174.D7(GND17) P174.D9(GND18) P174.E1(DUT_GND_SENSE) P174.E2(GND19) P174.E4(GND20) P174.E6(GND21) P174.E8(GND22) P174.F1(GND23) P174.F3(GND24) P174.F5(GND25) P174.F7(GND26) P174.F9(GND27) P174.G2(GND28) P174.G4(GND29) P174.G6(GND30) P174.G8(GND31) P174.H1(GND32) P174.H3(GND33) P174.H5(GND34) P174.H7(GND35) P174.H9(GND36) ; off-sheet GND, port GND
NetP154_A1: P154.A1(DIO28) ; port P154_HSD6571_DIO28
NetP154_A3: P154.A3(DIO06) ; port P154_HSD6571_DIO06
NetP154_A5: P154.A5(DIO04) ; port P154_HSD6571_DIO04
NetP154_A7: P154.A7(DIO02) ; port P154_HSD6571_DIO02
NetP154_A9: P154.A9(DIO00) ; port P154_HSD6571_DIO00
NetP154_B2: P154.B2(DIO07) ; port P154_HSD6571_DIO07
NetP154_B4: P154.B4(DIO05) ; port P154_HSD6571_DIO05
NetP154_B6: P154.B6(DIO03) ; port P154_HSD6571_DIO03
NetP154_B8: P154.B8(DIO01) ; port P154_HSD6571_DIO01
NetP154_C1: P154.C1(DIO29) ; port P154_HSD6571_DIO29
NetP154_C3: P154.C3(DIO14) ; port P154_HSD6571_DIO14
NetP154_C5: P154.C5(DIO12) ; port P154_HSD6571_DIO12
NetP154_C7: P154.C7(DIO10) ; port P154_HSD6571_DIO10
NetP154_C9: P154.C9(DIO08) ; port P154_HSD6571_DIO08
NetP154_D2: P154.D2(DIO15) ; port P154_HSD6571_DIO15
NetP154_D4: P154.D4(DIO13) ; port P154_HSD6571_DIO13
NetP154_D6: P154.D6(DIO11) ; port P154_HSD6571_DIO11
NetP154_D8: P154.D8(DIO09) ; port P154_HSD6571_DIO09
NetP154_E3: P154.E3(DIO22) ; port P154_HSD6571_DIO22
NetP154_E5: P154.E5(DIO20) ; port P154_HSD6571_DIO20
NetP154_E7: P154.E7(DIO18) ; port P154_HSD6571_DIO18
NetP154_E9: P154.E9(DIO16) ; port P154_HSD6571_DIO16
NetP154_F2: P154.F2(DIO23) ; port P154_HSD6571_DIO23
NetP154_F4: P154.F4(DIO21) ; port P154_HSD6571_DIO21
NetP154_F6: P154.F6(DIO19) ; port P154_HSD6571_DIO19
NetP154_F8: P154.F8(DIO17) ; port P154_HSD6571_DIO17
NetP154_G3: P154.G3(DIO26) ; port P154_HSD6571_DIO26
NetP154_G5: P154.G5(DIO30) ; port P154_HSD6571_DIO30
NetP154_G9: P154.G9(DIO24) ; port P154_HSD6571_DIO24
NetP154_H2: P154.H2(DIO27) ; port P154_HSD6571_DIO27
NetP154_H4: P154.H4(DIO31) ; port P154_HSD6571_DIO31
NetP154_H8: P154.H8(DIO25) ; port P154_HSD6571_DIO25
NetP174_A1: P174.A1(DIO28) ; port P174_HSD6571_DIO28
NetP174_A3: P174.A3(DIO06) ; port P174_HSD6571_DIO06
NetP174_A5: P174.A5(DIO04) ; port P174_HSD6571_DIO04
NetP174_A7: P174.A7(DIO02) ; port P174_HSD6571_DIO02
NetP174_A9: P174.A9(DIO00) ; port P174_HSD6571_DIO00
NetP174_B2: P174.B2(DIO07) ; port P174_HSD6571_DIO07
NetP174_B4: P174.B4(DIO05) ; port P174_HSD6571_DIO05
NetP174_B6: P174.B6(DIO03) ; port P174_HSD6571_DIO03
NetP174_B8: P174.B8(DIO01) ; port P174_HSD6571_DIO01
NetP174_C1: P174.C1(DIO29) ; port P174_HSD6571_DIO29
NetP174_C3: P174.C3(DIO14) ; port P174_HSD6571_DIO14
NetP174_C5: P174.C5(DIO12) ; port P174_HSD6571_DIO12
NetP174_C7: P174.C7(DIO10) ; port P174_HSD6571_DIO10
NetP174_C9: P174.C9(DIO08) ; port P174_HSD6571_DIO08
NetP174_D2: P174.D2(DIO15) ; port P174_HSD6571_DIO15
NetP174_D4: P174.D4(DIO13) ; port P174_HSD6571_DIO13
NetP174_D6: P174.D6(DIO11) ; port P174_HSD6571_DIO11
NetP174_D8: P174.D8(DIO09) ; port P174_HSD6571_DIO09
NetP174_E3: P174.E3(DIO22) ; port P174_HSD6571_DIO22
NetP174_E5: P174.E5(DIO20) ; port P174_HSD6571_DIO20
NetP174_E7: P174.E7(DIO18) ; port P174_HSD6571_DIO18
NetP174_E9: P174.E9(DIO16) ; port P174_HSD6571_DIO16
NetP174_F2: P174.F2(DIO23) ; port P174_HSD6571_DIO23
NetP174_F4: P174.F4(DIO21) ; port P174_HSD6571_DIO21
NetP174_F6: P174.F6(DIO19) ; port P174_HSD6571_DIO19
NetP174_F8: P174.F8(DIO17) ; port P174_HSD6571_DIO17
NetP174_G3: P174.G3(DIO26) ; port P174_HSD6571_DIO26
NetP174_G5: P174.G5(DIO30) ; port P174_HSD6571_DIO30
NetP174_G9: P174.G9(DIO24) ; port P174_HSD6571_DIO24
NetP174_H2: P174.H2(DIO27) ; port P174_HSD6571_DIO27
NetP174_H4: P174.H4(DIO31) ; port P174_HSD6571_DIO31
NetP174_H8: P174.H8(DIO25) ; port P174_HSD6571_DIO25

Not connected (* = marked no-connect by the designer): P154 G1(RESERVED1)* G7(RESERVED2)* H6(RESERVED3)*; P174 G1(RESERVED1)* G7(RESERVED2)* H6(RESERVED3)*

### Notes on the sheet
- DIGITAL
- DIGITAL 6571
- P154
- P174
- BANK 1
- 00-07
- BANK 2
- 08-15
- BANK 3
- 16-23
- BANK 4
- 24-31
- DGS
- (near P154) Connect the DGS pin to a
  single point near the DUT.
- (near P174) Connect the DGS pin to a
  single point near the DUT.
- (in symbol HE_DEFAULT) www.harbor-electronics.com; TITLE:; PROJECT:; DEVICE:; PROJECT NO:; SHEET NAME:; DESIGNER:; ENGINEER:; SO NUMBER:; CONTROL NUMBER:; REV:; VER:; CONFIDENTIAL: THIS DOCUMENT CONTAINS INFORMATION WHICH IS THE PROPERTY OF; HARBOR ELECTRONICS, INC. THIS DOCUMENT IS RECEIVED IN CONFIDENCE AND ITS CONTENTS MAY NOT; SHEET:; OF:; BE DISCLOSED OR REPRODUCED WITHOUT THE PRIOR WRITTEN CONSENT OF HARBOR ELECTRONICS, INC.

### Library data of the parts
*#4 = HE_DEFAULT: as *#1 on sheet 01-TITLE
P154 P174 = HSD6571: SPLIT_INST: TRUE; SWAP_INFO: (S1+S2+S3+S4+S5+S6+S7); PCB Footprint: 285092A-08_72PIN

## Sheet 42-MIO.SchDoc
size 594 x 420 mm
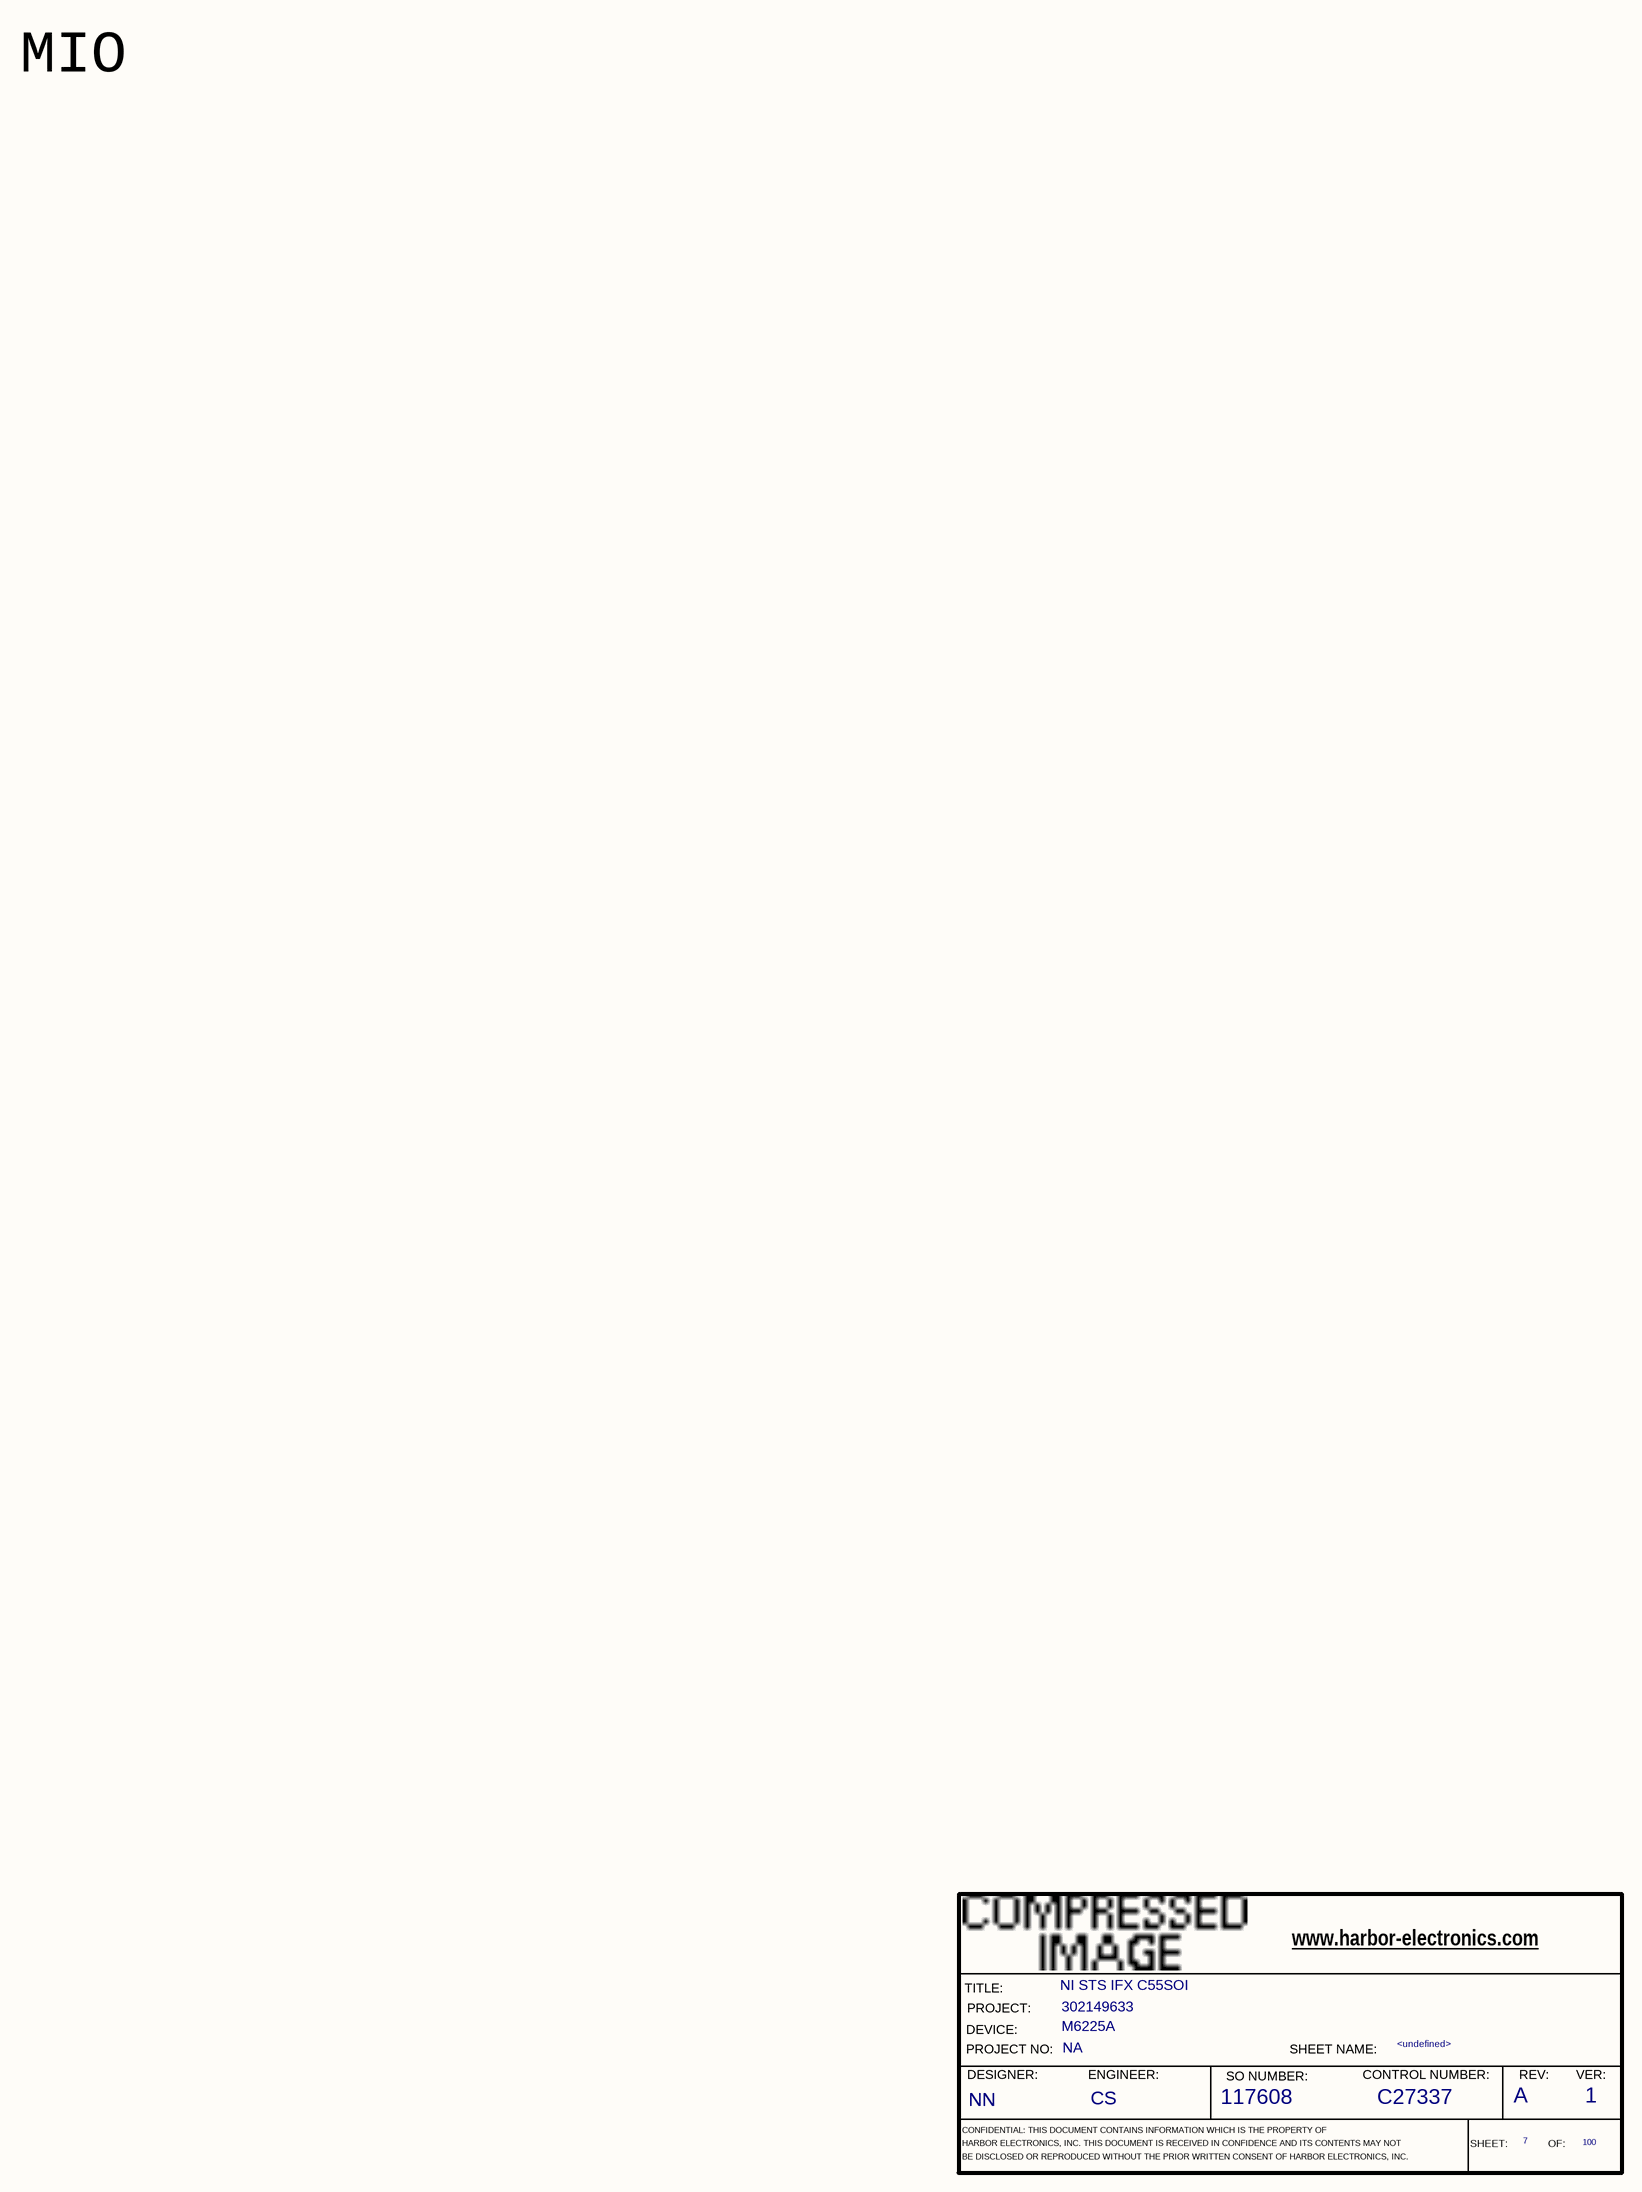
[diagram p13: 42-MIO.SchDoc]

### Parts
(Parts that share a designator on the sheet are numbered #1, #2 ... from top to bottom, then left to right.)
*#5  RevCode: A  Title: NI STS IFX C55SOI  Page Number: 7  Page Count: 100  Engineer: CS  Designer: NN  SO Number: 117608  Control Number: C27337  Version: 1  Page Name: <undefined>  PROJECT: 302149633  DEVICE: M6225A  PROJECT NO.: NA  (hidden comment: HE_DEFAULT)  (graphical)

### Notes on the sheet
- MIO
- (in symbol HE_DEFAULT) www.harbor-electronics.com; TITLE:; PROJECT:; DEVICE:; PROJECT NO:; SHEET NAME:; DESIGNER:; ENGINEER:; SO NUMBER:; CONTROL NUMBER:; REV:; VER:; CONFIDENTIAL: THIS DOCUMENT CONTAINS INFORMATION WHICH IS THE PROPERTY OF; HARBOR ELECTRONICS, INC. THIS DOCUMENT IS RECEIVED IN CONFIDENCE AND ITS CONTENTS MAY NOT; SHEET:; OF:; BE DISCLOSED OR REPRODUCED WITHOUT THE PRIOR WRITTEN CONSENT OF HARBOR ELECTRONICS, INC.

### Library data of the parts
*#5 = HE_DEFAULT: as *#1 on sheet 01-TITLE

## Sheet 47-SOURCES_AWG.SchDoc
size 594 x 420 mm
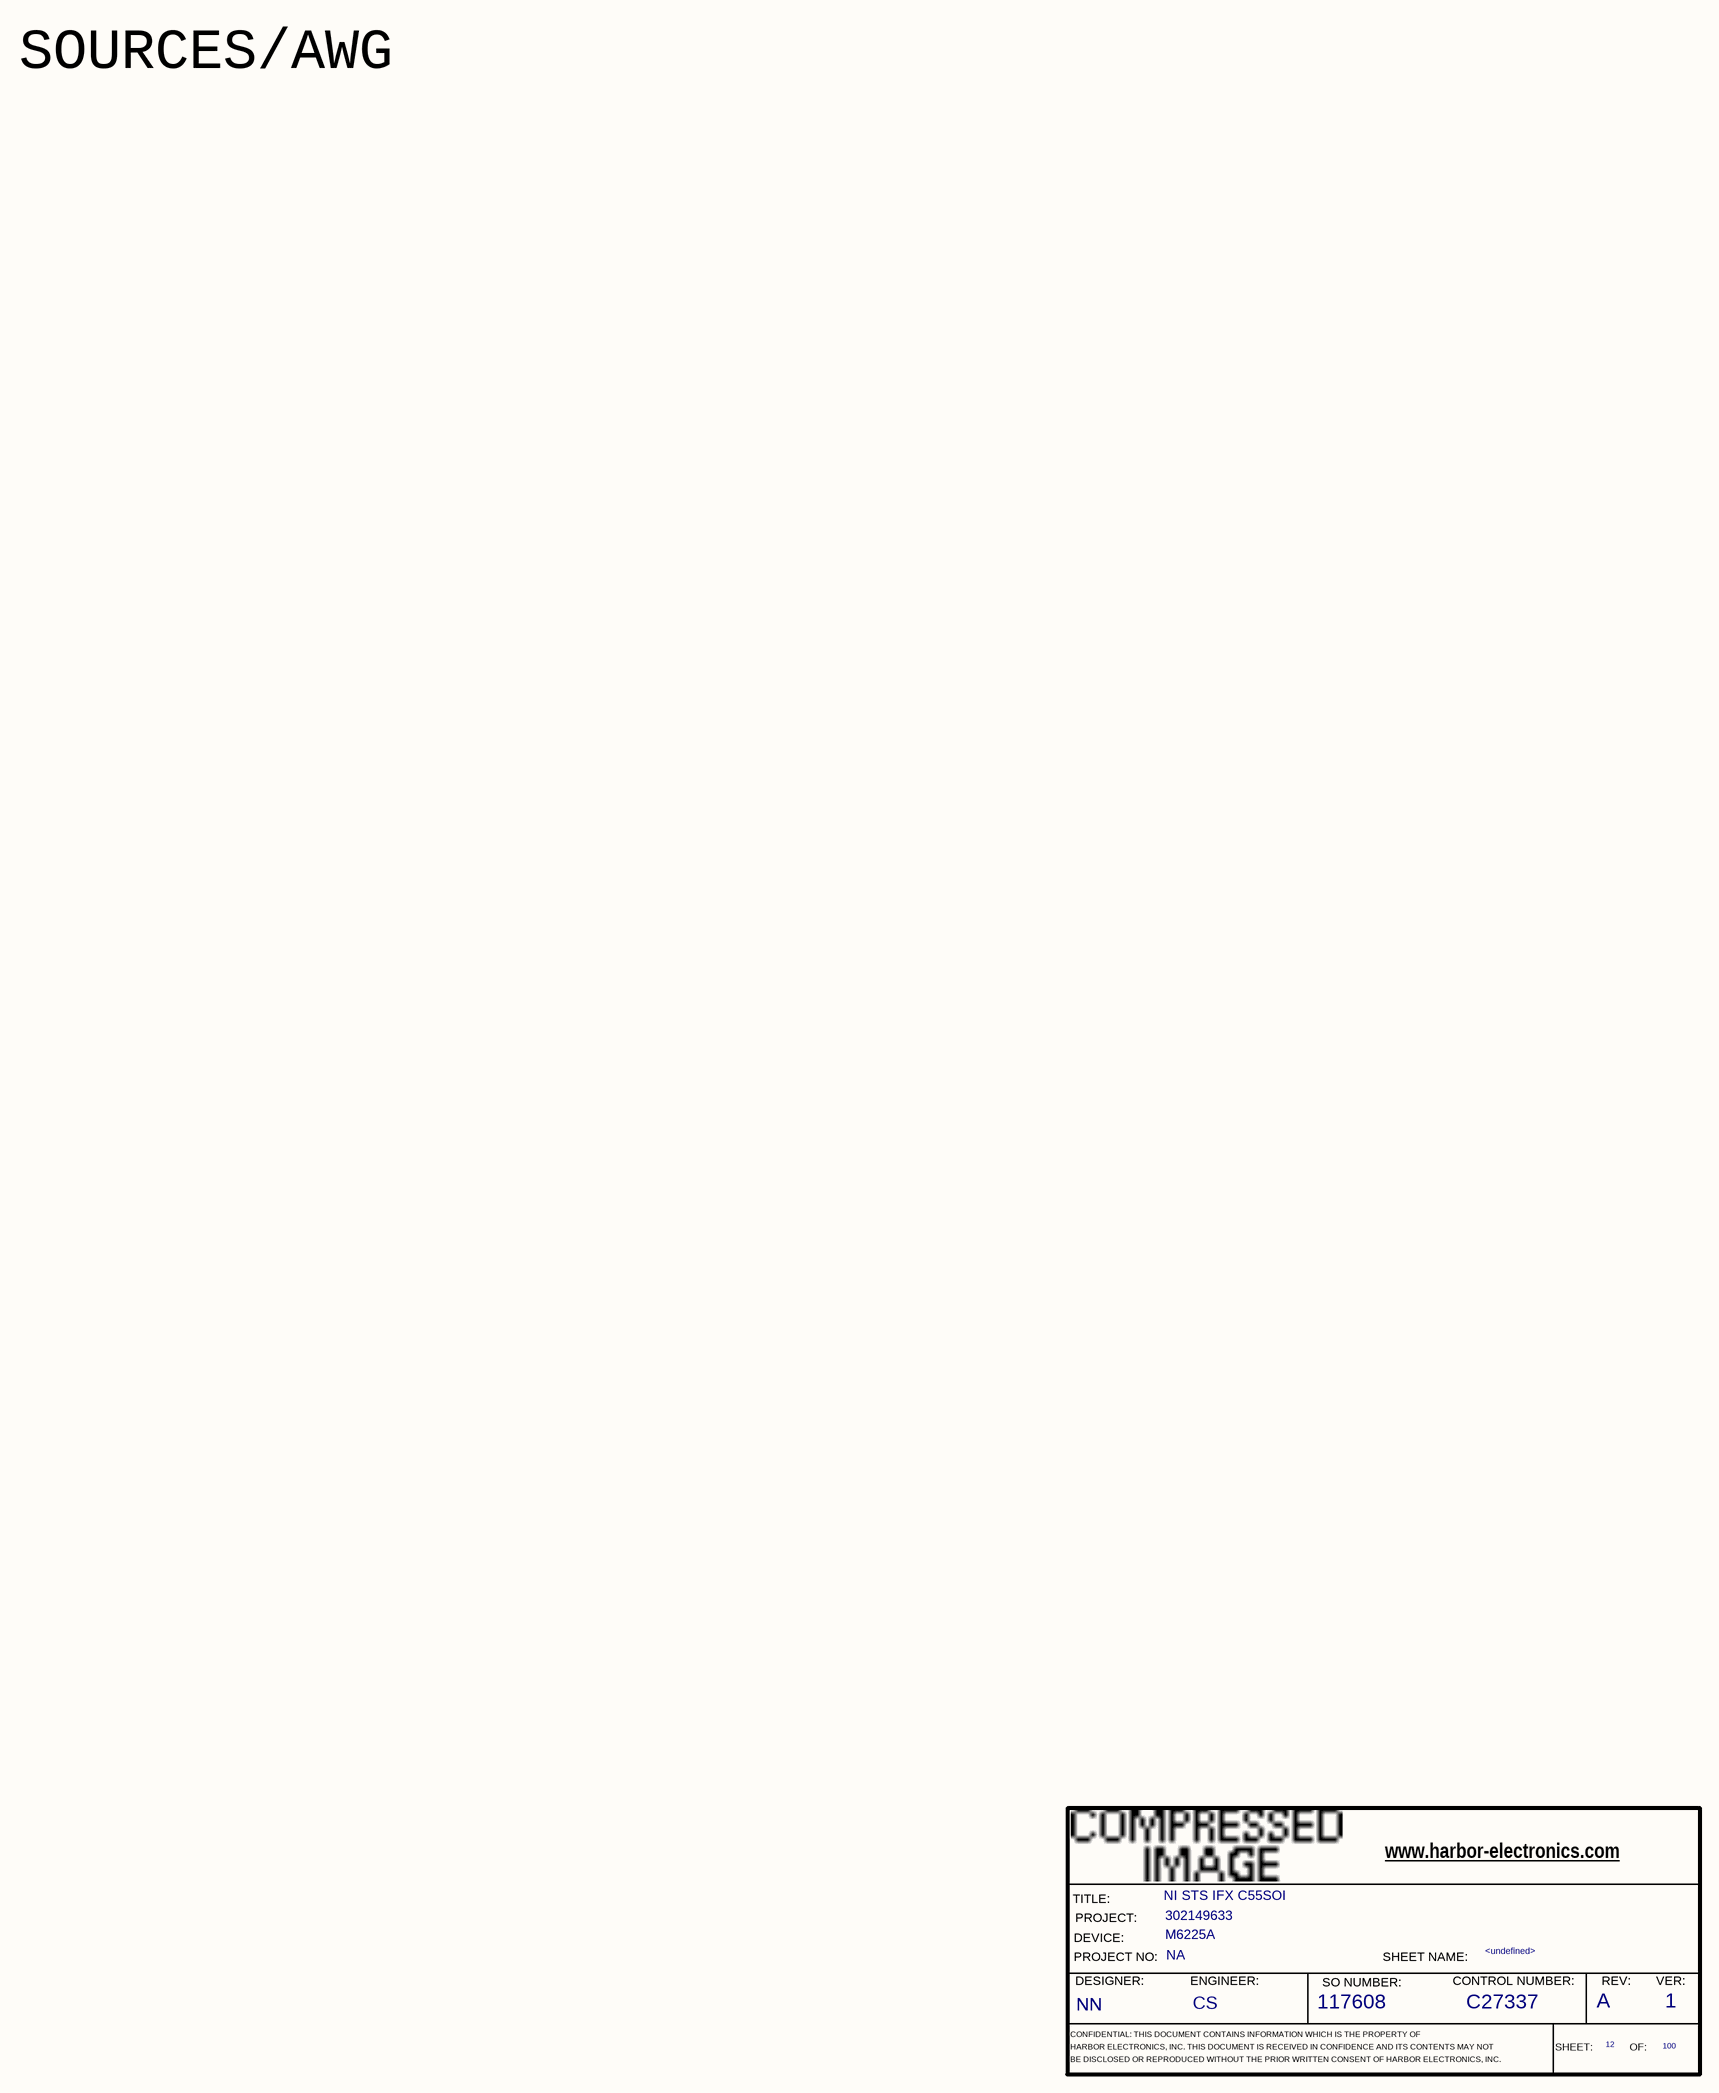
[diagram p14: 47-SOURCES_AWG.SchDoc]

### Parts
(Parts that share a designator on the sheet are numbered #1, #2 ... from top to bottom, then left to right.)
*#6  RevCode: A  Title: NI STS IFX C55SOI  Page Number: 12  Page Count: 100  Engineer: CS  Designer: NN  SO Number: 117608  Control Number: C27337  Version: 1  Page Name: <undefined>  PROJECT: 302149633  DEVICE: M6225A  PROJECT NO.: NA  (hidden comment: HE_DEFAULT)  (graphical)

### Notes on the sheet
- SOURCES/AWG
- (in symbol HE_DEFAULT) www.harbor-electronics.com; TITLE:; PROJECT:; DEVICE:; PROJECT NO:; SHEET NAME:; DESIGNER:; ENGINEER:; SO NUMBER:; CONTROL NUMBER:; REV:; VER:; CONFIDENTIAL: THIS DOCUMENT CONTAINS INFORMATION WHICH IS THE PROPERTY OF; HARBOR ELECTRONICS, INC. THIS DOCUMENT IS RECEIVED IN CONFIDENCE AND ITS CONTENTS MAY NOT; SHEET:; OF:; BE DISCLOSED OR REPRODUCED WITHOUT THE PRIOR WRITTEN CONSENT OF HARBOR ELECTRONICS, INC.

### Library data of the parts
*#6 = HE_DEFAULT: as *#1 on sheet 01-TITLE

## Sheet 51-BLANK 121-140.SchDoc
size 594 x 420 mm
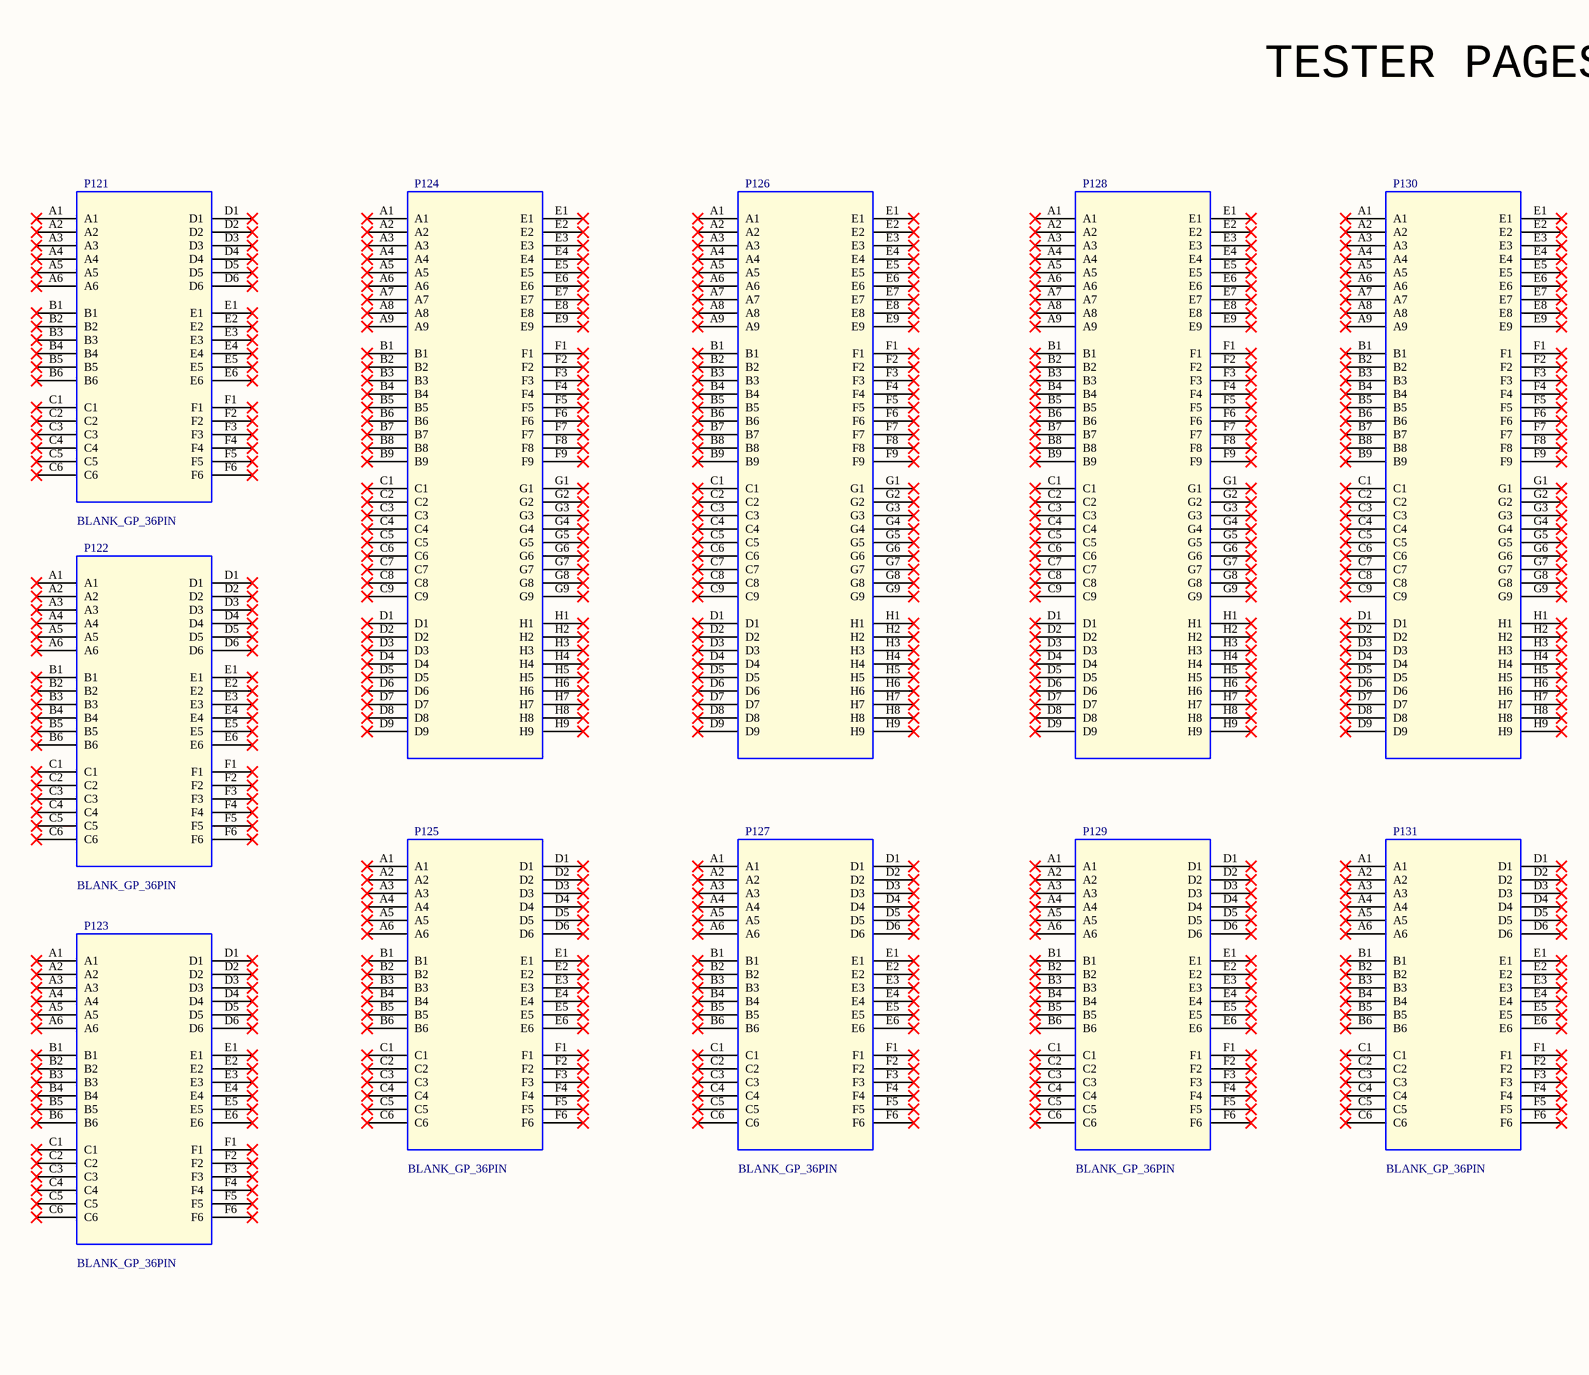
[diagram p15: 51-BLANK 121-140.SchDoc, left]
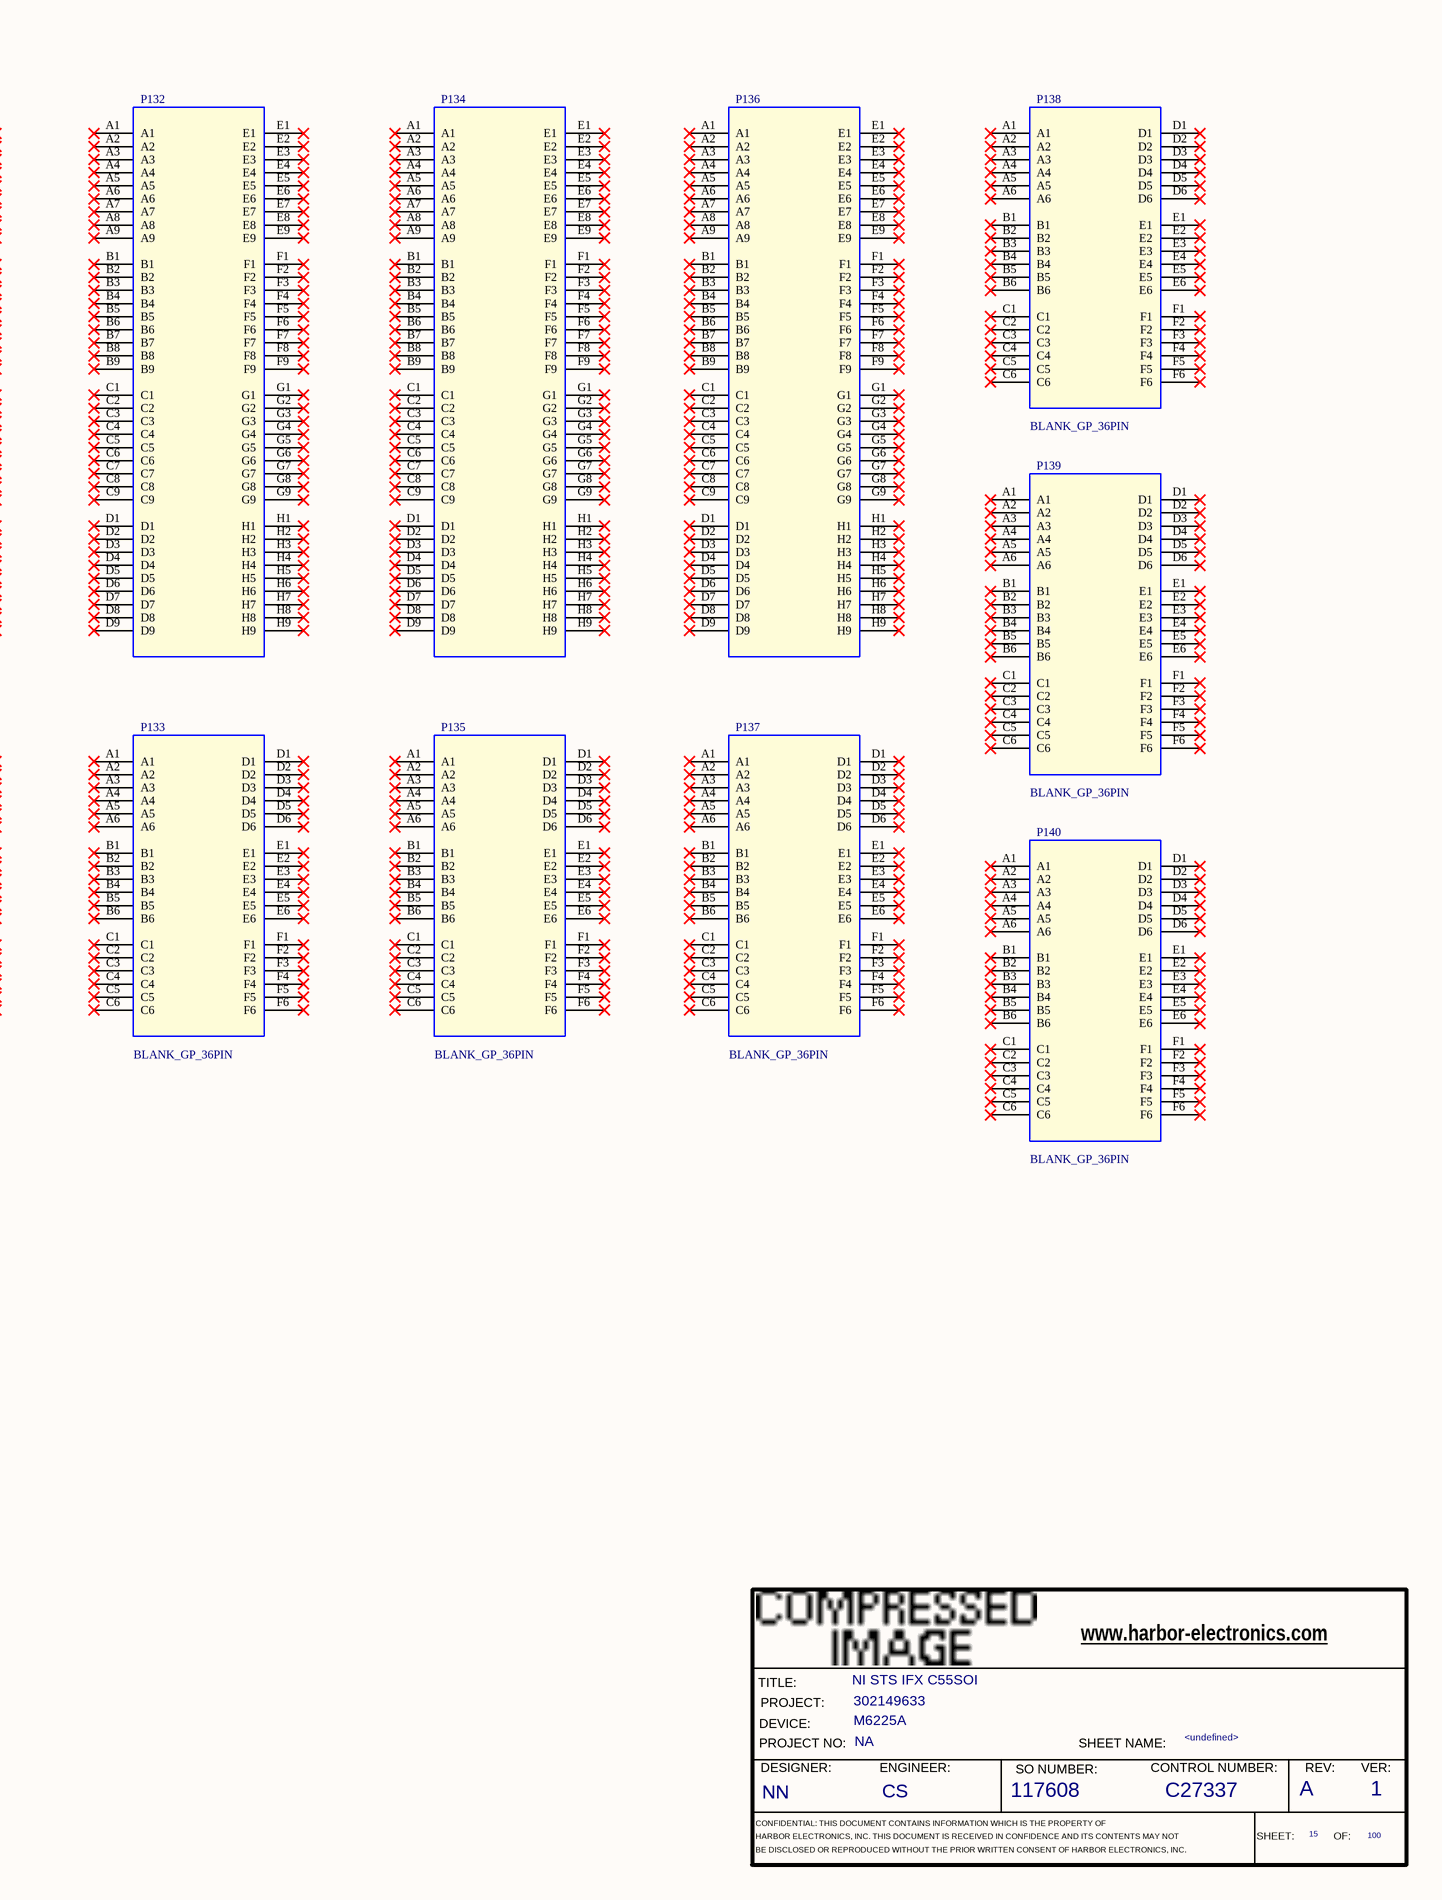
[diagram p16: 51-BLANK 121-140.SchDoc, right]

### Parts
(Parts that share a designator on the sheet are numbered #1, #2 ... from top to bottom, then left to right.)
*#7  RevCode: A  Title: NI STS IFX C55SOI  Page Number: 15  Page Count: 100  Engineer: CS  Designer: NN  SO Number: 117608  Control Number: C27337  Version: 1  Page Name: <undefined>  PROJECT: 302149633  DEVICE: M6225A  PROJECT NO.: NA  (hidden comment: HE_DEFAULT)  (graphical)
P121  BLANK_GP_36PIN  [285092A-08_36PIN_NOVIA]
P122  BLANK_GP_36PIN  [285092A-08_36PIN_NOVIA]
P123  BLANK_GP_36PIN  [285092A-08_36PIN_NOVIA]
P124  (no value)  [285092A-08_72PIN_NOVIA]
P125  BLANK_GP_36PIN  [285092A-08_36PIN_NOVIA]
P126  (no value)  [285092A-08_72PIN_NOVIA]
P127  BLANK_GP_36PIN  [285092A-08_36PIN_NOVIA]
P128  (no value)  [285092A-08_72PIN_NOVIA]
P129  BLANK_GP_36PIN  [285092A-08_36PIN_NOVIA]
P130  (no value)  [285092A-08_72PIN_NOVIA]
P131  BLANK_GP_36PIN  [285092A-08_36PIN_NOVIA]
P132  (no value)  [285092A-08_72PIN_NOVIA]
P133  BLANK_GP_36PIN  [285092A-08_36PIN_NOVIA]
P134  (no value)  [285092A-08_72PIN_NOVIA]
P135  BLANK_GP_36PIN  [285092A-08_36PIN_NOVIA]
P136  (no value)  [285092A-08_72PIN_NOVIA]
P137  BLANK_GP_36PIN  [285092A-08_36PIN_NOVIA]
P138  BLANK_GP_36PIN  [285092A-08_36PIN_NOVIA]
P139  BLANK_GP_36PIN  [285092A-08_36PIN_NOVIA]
P140  BLANK_GP_36PIN  [285092A-08_36PIN_NOVIA]

### Nets

Not connected (* = marked no-connect by the designer): P121 A1* A2* A3* A4* A5* A6* B1* B2* B3* B4* B5* B6* C1* C2* C3* C4* C5* C6* D1* D2* D3* D4* D5* D6* E1* E2* E3* E4* E5* E6* F1* F2* F3* F4* F5* F6*; P122 A1* A2* A3* A4* A5* A6* B1* B2* B3* B4* B5* B6* C1* C2* C3* C4* C5* C6* D1* D2* D3* D4* D5* D6* E1* E2* E3* E4* E5* E6* F1* F2* F3* F4* F5* F6*; P123 A1* A2* A3* A4* A5* A6* B1* B2* B3* B4* B5* B6* C1* C2* C3* C4* C5* C6* D1* D2* D3* D4* D5* D6* E1* E2* E3* E4* E5* E6* F1* F2* F3* F4* F5* F6*; P124 A1* A2* A3* A4* A5* A6* A7* A8* A9* B1* B2* B3* B4* B5* B6* B7* B8* B9* C1* C2* C3* C4* C5* C6* C7* C8* C9* D1* D2* D3* D4* D5* D6* D7* D8* D9* E1* E2* E3* E4* E5* E6* E7* E8* E9* F1* F2* F3* F4* F5* F6* F7* F8* F9* G1* G2* G3* G4* G5* G6* G7* G8* G9* H1* H2* H3* H4* H5* H6* H7* H8* H9*; P125 A1* A2* A3* A4* A5* A6* B1* B2* B3* B4* B5* B6* C1* C2* C3* C4* C5* C6* D1* D2* D3* D4* D5* D6* E1* E2* E3* E4* E5* E6* F1* F2* F3* F4* F5* F6*; P126 A1* A2* A3* A4* A5* A6* A7* A8* A9* B1* B2* B3* B4* B5* B6* B7* B8* B9* C1* C2* C3* C4* C5* C6* C7* C8* C9* D1* D2* D3* D4* D5* D6* D7* D8* D9* E1* E2* E3* E4* E5* E6* E7* E8* E9* F1* F2* F3* F4* F5* F6* F7* F8* F9* G1* G2* G3* G4* G5* G6* G7* G8* G9* H1* H2* H3* H4* H5* H6* H7* H8* H9*; P127 A1* A2* A3* A4* A5* A6* B1* B2* B3* B4* B5* B6* C1* C2* C3* C4* C5* C6* D1* D2* D3* D4* D5* D6* E1* E2* E3* E4* E5* E6* F1* F2* F3* F4* F5* F6*; P128 A1* A2* A3* A4* A5* A6* A7* A8* A9* B1* B2* B3* B4* B5* B6* B7* B8* B9* C1* C2* C3* C4* C5* C6* C7* C8* C9* D1* D2* D3* D4* D5* D6* D7* D8* D9* E1* E2* E3* E4* E5* E6* E7* E8* E9* F1* F2* F3* F4* F5* F6* F7* F8* F9* G1* G2* G3* G4* G5* G6* G7* G8* G9* H1* H2* H3* H4* H5* H6* H7* H8* H9*; P129 A1* A2* A3* A4* A5* A6* B1* B2* B3* B4* B5* B6* C1* C2* C3* C4* C5* C6* D1* D2* D3* D4* D5* D6* E1* E2* E3* E4* E5* E6* F1* F2* F3* F4* F5* F6*; P130 A1* A2* A3* A4* A5* A6* A7* A8* A9* B1* B2* B3* B4* B5* B6* B7* B8* B9* C1* C2* C3* C4* C5* C6* C7* C8* C9* D1* D2* D3* D4* D5* D6* D7* D8* D9* E1* E2* E3* E4* E5* E6* E7* E8* E9* F1* F2* F3* F4* F5* F6* F7* F8* F9* G1* G2* G3* G4* G5* G6* G7* G8* G9* H1* H2* H3* H4* H5* H6* H7* H8* H9*; P131 A1* A2* A3* A4* A5* A6* B1* B2* B3* B4* B5* B6* C1* C2* C3* C4* C5* C6* D1* D2* D3* D4* D5* D6* E1* E2* E3* E4* E5* E6* F1* F2* F3* F4* F5* F6*; P132 A1* A2* A3* A4* A5* A6* A7* A8* A9* B1* B2* B3* B4* B5* B6* B7* B8* B9* C1* C2* C3* C4* C5* C6* C7* C8* C9* D1* D2* D3* D4* D5* D6* D7* D8* D9* E1* E2* E3* E4* E5* E6* E7* E8* E9* F1* F2* F3* F4* F5* F6* F7* F8* F9* G1* G2* G3* G4* G5* G6* G7* G8* G9* H1* H2* H3* H4* H5* H6* H7* H8* H9*; P133 A1* A2* A3* A4* A5* A6* B1* B2* B3* B4* B5* B6* C1* C2* C3* C4* C5* C6* D1* D2* D3* D4* D5* D6* E1* E2* E3* E4* E5* E6* F1* F2* F3* F4* F5* F6*; P134 A1* A2* A3* A4* A5* A6* A7* A8* A9* B1* B2* B3* B4* B5* B6* B7* B8* B9* C1* C2* C3* C4* C5* C6* C7* C8* C9* D1* D2* D3* D4* D5* D6* D7* D8* D9* E1* E2* E3* E4* E5* E6* E7* E8* E9* F1* F2* F3* F4* F5* F6* F7* F8* F9* G1* G2* G3* G4* G5* G6* G7* G8* G9* H1* H2* H3* H4* H5* H6* H7* H8* H9*; P135 A1* A2* A3* A4* A5* A6* B1* B2* B3* B4* B5* B6* C1* C2* C3* C4* C5* C6* D1* D2* D3* D4* D5* D6* E1* E2* E3* E4* E5* E6* F1* F2* F3* F4* F5* F6*; P136 A1* A2* A3* A4* A5* A6* A7* A8* A9* B1* B2* B3* B4* B5* B6* B7* B8* B9* C1* C2* C3* C4* C5* C6* C7* C8* C9* D1* D2* D3* D4* D5* D6* D7* D8* D9* E1* E2* E3* E4* E5* E6* E7* E8* E9* F1* F2* F3* F4* F5* F6* F7* F8* F9* G1* G2* G3* G4* G5* G6* G7* G8* G9* H1* H2* H3* H4* H5* H6* H7* H8* H9*; P137 A1* A2* A3* A4* A5* A6* B1* B2* B3* B4* B5* B6* C1* C2* C3* C4* C5* C6* D1* D2* D3* D4* D5* D6* E1* E2* E3* E4* E5* E6* F1* F2* F3* F4* F5* F6*; P138 A1* A2* A3* A4* A5* A6* B1* B2* B3* B4* B5* B6* C1* C2* C3* C4* C5* C6* D1* D2* D3* D4* D5* D6* E1* E2* E3* E4* E5* E6* F1* F2* F3* F4* F5* F6*; P139 A1* A2* A3* A4* A5* A6* B1* B2* B3* B4* B5* B6* C1* C2* C3* C4* C5* C6* D1* D2* D3* D4* D5* D6* E1* E2* E3* E4* E5* E6* F1* F2* F3* F4* F5* F6*; P140 A1* A2* A3* A4* A5* A6* B1* B2* B3* B4* B5* B6* C1* C2* C3* C4* C5* C6* D1* D2* D3* D4* D5* D6* E1* E2* E3* E4* E5* E6* F1* F2* F3* F4* F5* F6*

### Notes on the sheet
- TESTER PAGES
- (in symbol HE_DEFAULT) www.harbor-electronics.com; TITLE:; PROJECT:; DEVICE:; PROJECT NO:; SHEET NAME:; DESIGNER:; ENGINEER:; SO NUMBER:; CONTROL NUMBER:; REV:; VER:; CONFIDENTIAL: THIS DOCUMENT CONTAINS INFORMATION WHICH IS THE PROPERTY OF; HARBOR ELECTRONICS, INC. THIS DOCUMENT IS RECEIVED IN CONFIDENCE AND ITS CONTENTS MAY NOT; SHEET:; OF:; BE DISCLOSED OR REPRODUCED WITHOUT THE PRIOR WRITTEN CONSENT OF HARBOR ELECTRONICS, INC.

### Library data of the parts
*#7 = HE_DEFAULT: as *#1 on sheet 01-TITLE
P121-P123 P125 P127 P129 P131 P133 P135 P137-P140 = BLANK_GP_36PIN: ALT_SYMBOLS: 285092A-08_36PIN; PCB Footprint: 285092A-08_36PIN_NOVIA
P124 P126 P128 P130 P132 P134 P136 = BLANK_COAX_72PIN: ALT_SYMBOLS: 285092A-08_72PIN; PCB Footprint: 285092A-08_72PIN_NOVIA